# EAGLE design nrf91-feather (EAGLE 9.6.2)
AUTHOR: Jared Wolff; BOARD_NUMBER: BRD-0015; COMPANY: Circuit Dojo; DOC_NUMBER: SCH-0015; DOC_REV: 6; PN: PS-NRF91-FEATHER; TITLE: nRF91 Feather
Assembly variants: Production

## Sheet 1 of 3: Power + Headers
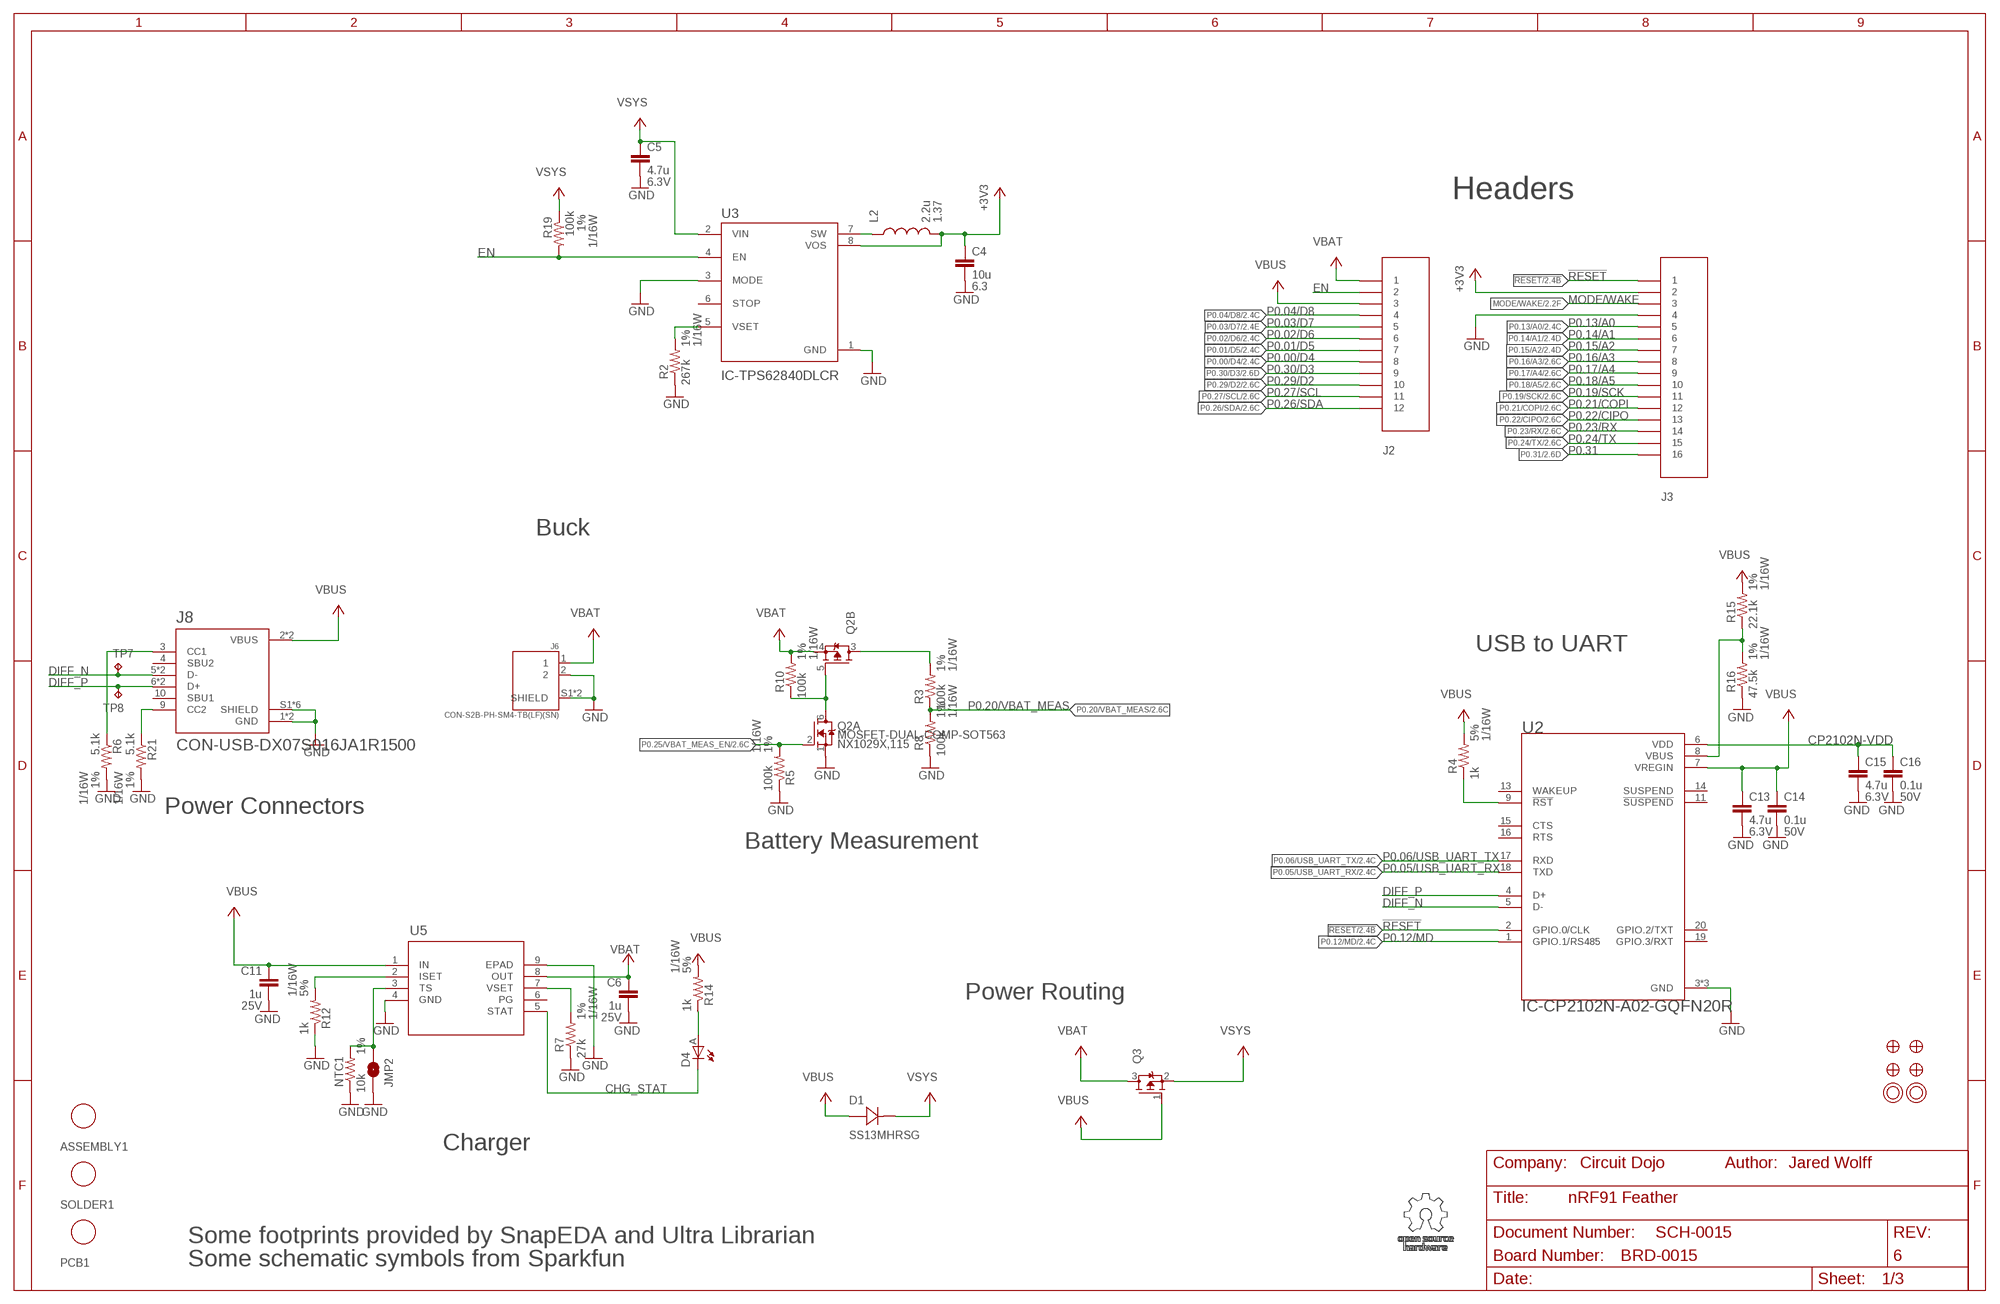
[diagram p0: schematic, sheet 1]

### Parts
ASSEMBLY1  ASSY-COST-NRF91-FEATHER  [PLACEHOLDER]
C4  10u  CAP-10U-6.3V-0603  [C0603]
C5  4.7u  CAP-4.7U-6.3V-2-0603  [C0603]
C6  1u  CAP-1U-25V-1-0402  [CAPC1005X55N]
C11  1u  CAP-1U-25V-1-0402  [CAPC1005X55N]
C13  4.7u  CAP-4.7U-6.3V-2-0603  [C0603]
C14  0.1u  CAP-0.1U-50V-0402  [CAPC1005X55N]
C15  4.7u  CAP-4.7U-6.3V-2-0603  [C0603]
C16  0.1u  CAP-0.1U-50V-0402  [CAPC1005X55N]
D1  DIO-SCHOTTKY-1A-SMA-MICRO  [SMA-MICRO]
D4  LED-ORANGE-0402  [LED_EAST1005]
J2  CON-HEADER-1X12-MALE-PIN  [CON-HEADER-1X12-MALE-PIN]  (not fitted in variant Production)
J3  CON-HEADER-1X16-MALE-PIN  [CON-HEADER-1X16-MALE-PIN]  (not fitted in variant Production)
J6  CON-S2B-PH-SM4-TB(LF)(SN)  [JST_S2B-PH-SM4-TB(LF)(SN)]
J8  CON-USB-DX07S016JA1R1500  [JAE_DX07S016JA1R1500]
JMP2  JUMPER-NO-ROUND-NO  [JUMPER-ROUND-N0]
L2  2.2u  IND-2.2U-1.37A-2X2  [IND-2P0X2P0X1P2]
NTC1  10k  NTC-10K-1%-0402  [R0402-M]
PCB1  PCB-NRF91-FEATHER  [PLACEHOLDER]
Q2  MOSFET-DUAL-COMP-SOT563  [SOT50P160X60-6N]
Q3  MOSFET-P-20V-4.7A-SOT23  [SOT23]
R2  267k  RES-267K-1%-0402  [R0402-M]
R3  100k  RES-100K-1%-0402  [R0402-M]
R4  1k  RES-1K-5%-0402  [R0402-M]
R5  100k  RES-100K-1%-0402  [R0402-M]
R6  5.1k  RES-5.1K-1%-0402  [R0402-M]
R7  27k  RES-27K-1%-0402  [R0402-M]
R8  100k  RES-100K-1%-0402  [R0402-M]
R10  100k  RES-100K-1%-0402  [R0402-M]
R12  1k  RES-1K-5%-0402  [R0402-M]
R14  1k  RES-1K-5%-0402  [R0402-M]
R15  22.1k  RES-22.1K-1%-0402  [R0402-M]
R16  47.5k  RES-47.5K-1%-0402  [R0402-M]
R19  100k  RES-100K-1%-0402  [R0402-M]
R21  5.1k  RES-5.1K-1%-0402  [R0402-M]
SOLDER1  SOLDER-PASTE-ROOM-TEMP-50G  [PLACEHOLDER]
TP7  TP-1SIDE-1P0  [TP-1P0]
TP8  TP-1SIDE-1P0  [TP-1P0]
U2  IC-CP2102N-A02-GQFN20R  [SILABS_CP2102N-A02-GQFN20R]
U3  IC-TPS62840DLCR  [SON50P200X150X100-8N]
U5  IC-BQ25170JDSGR-WSON8  [WSON8_BQ2517_TEX-L]
U$3  FIDUCIAL-1MM  [FIDUCIAL-1MM]  (not fitted in variant Production)
U$4  FIDUCIAL-1MM  [FIDUCIAL-1MM]  (not fitted in variant Production)
U$31  MOUNTING-HOLE-2.5MM-PLATED  [MOUNTING-HOLE-2.5MM-PLATED]  (not fitted in variant Production)
U$32  MOUNTING-HOLE-2.5MM-PLATED  [MOUNTING-HOLE-2.5MM-PLATED]  (not fitted in variant Production)
U$34  FIDUCIAL-1MM  [FIDUCIAL-1MM]  (not fitted in variant Production)
U$35  FIDUCIAL-1MM  [FIDUCIAL-1MM]  (not fitted in variant Production)

### Nets
!RESET: J3.1 U2.2(GPIO.0/CLK) ; also sheet 2
+3V3: C4.1 J3.2 L2.P$2 U3.8(VOS) ; also sheet 2,3
CHG_ISET: R12.2 U5.2(ISET)
CHG_STAT: D4.C U5.5(STAT)
CHG_TS: JMP2.P$1 NTC1.2 U5.3(TS)
CHG_VSET: R7.2 U5.7(VSET)
CP2102N-!RST: R4.1 U2.9(!RST)
CP2102N-VDD: C15.1 C16.1 U2.6(VDD)
DIFF_N [usb]: J8.5(D-) J8.8(D-) TP7.TP U2.5(D-)
DIFF_P [usb]: J8.6(D+) J8.7(D+) TP8.TP U2.4(D+)
EN: J2.2 R19.2 U3.4(EN)
GND: C4.2 C5.2 C6.2 C11.2 C13.2 C14.2 C15.2 C16.2 J3.4 J6.2 J6.S1(SHIELD) J6.S2(SHIELD) J8.1(GND) J8.12(GND) J8.S1(SHIELD) J8.S2(SHIELD) J8.S3(SHIELD) J8.S4(SHIELD) J8.S5(SHIELD) J8.S6(SHIELD) JMP2.P$2 NTC1.1 Q2.1(A:S) R2.1 R5.1 R6.2 R7.1 R8.1 R12.1 R16.1 R21.2 U2.3(GND) U2.12(GND) U2.21(GND) U3.1(GND) U3.3(MODE) U5.4(GND) U5.9(EPAD) ; also sheet 2,3
MODE/WAKE: J3.3 ; also sheet 2
N$1: R2.2 U3.5(VSET)
N$2: L2.P$1 U3.7(SW)
N$6: Q2.3(B:D) R3.2
N$7: Q2.5(B:G) Q2.6(A:D) R10.1
N$11: R15.1 R16.2 U2.8(VBUS)
N$13: D4.A R14.1
P0.00/D4: J2.8 ; also sheet 2
P0.01/D5: J2.7 ; also sheet 2
P0.02/D6: J2.6 ; also sheet 2
P0.03/D7: J2.5 ; also sheet 2
P0.04/D8: J2.4 ; also sheet 2,3
P0.05/USB_UART_RX: U2.18(TXD) ; also sheet 2
P0.06/USB_UART_TX: U2.17(RXD) ; also sheet 2
P0.12/MD: U2.1(GPIO.1/RS485) ; also sheet 2
P0.13/A0: J3.5 ; also sheet 2
P0.14/A1: J3.6 ; also sheet 2
P0.15/A2: J3.7 ; also sheet 2
P0.16/A3: J3.8 ; also sheet 2
P0.17/A4: J3.9 ; also sheet 2
P0.18/A5: J3.10 ; also sheet 2
P0.19/SCK: J3.11 ; also sheet 2
P0.20/VBAT_MEAS: R3.1 R8.2 ; also sheet 2
P0.21/COPI: J3.12 ; also sheet 2
P0.22/CIPO: J3.13 ; also sheet 2
P0.23/RX: J3.14 ; also sheet 2
P0.24/TX: J3.15 ; also sheet 2
P0.25/VBAT_MEAS_EN: Q2.2(A:G) R5.2 ; also sheet 2
P0.26/SDA: J2.12 ; also sheet 2,3
P0.27/SCL: J2.11 ; also sheet 2,3
P0.29/D2: J2.10 ; also sheet 2,3
P0.30/D3: J2.9 ; also sheet 2,3
P0.31: J3.16 ; also sheet 2
USB_CC1: J8.3(CC1) R6.1
USB_CC2: J8.9(CC2) R21.1
VBAT: C6.1 J2.1 J6.1 Q2.4(B:S) Q3.3(D) R10.2 U5.8(OUT)
VBUS: C11.1 C13.1 C14.1 D1.2 J2.3 J8.2(VBUS) J8.11(VBUS) Q3.1(G) R4.2 R14.2 R15.2 U2.7(VREGIN) U5.1(IN)
VSYS: C5.1 D1.1 Q3.2(S) R19.1 U3.2(VIN) ; also sheet 2
Unconnected: J8.4(SBU2) J8.10(SBU1) U2.11(!SUSPEND) U2.13(WAKEUP) U2.14(SUSPEND) U2.15(CTS) U2.16(RTS) U2.19(GPIO.3/RXT) U2.20(GPIO.2/TXT) U3.6(STOP) U5.6(PG)

### Notes on the sheet
- Headers
- Buck
- USB to UART
- Power Connectors
- Battery Measurement
- Power Routing
- Charger
- Some footprints provided by SnapEDA and Ultra Librarian
- Some schematic symbols from Sparkfun

## Sheet 2 of 3: Processor
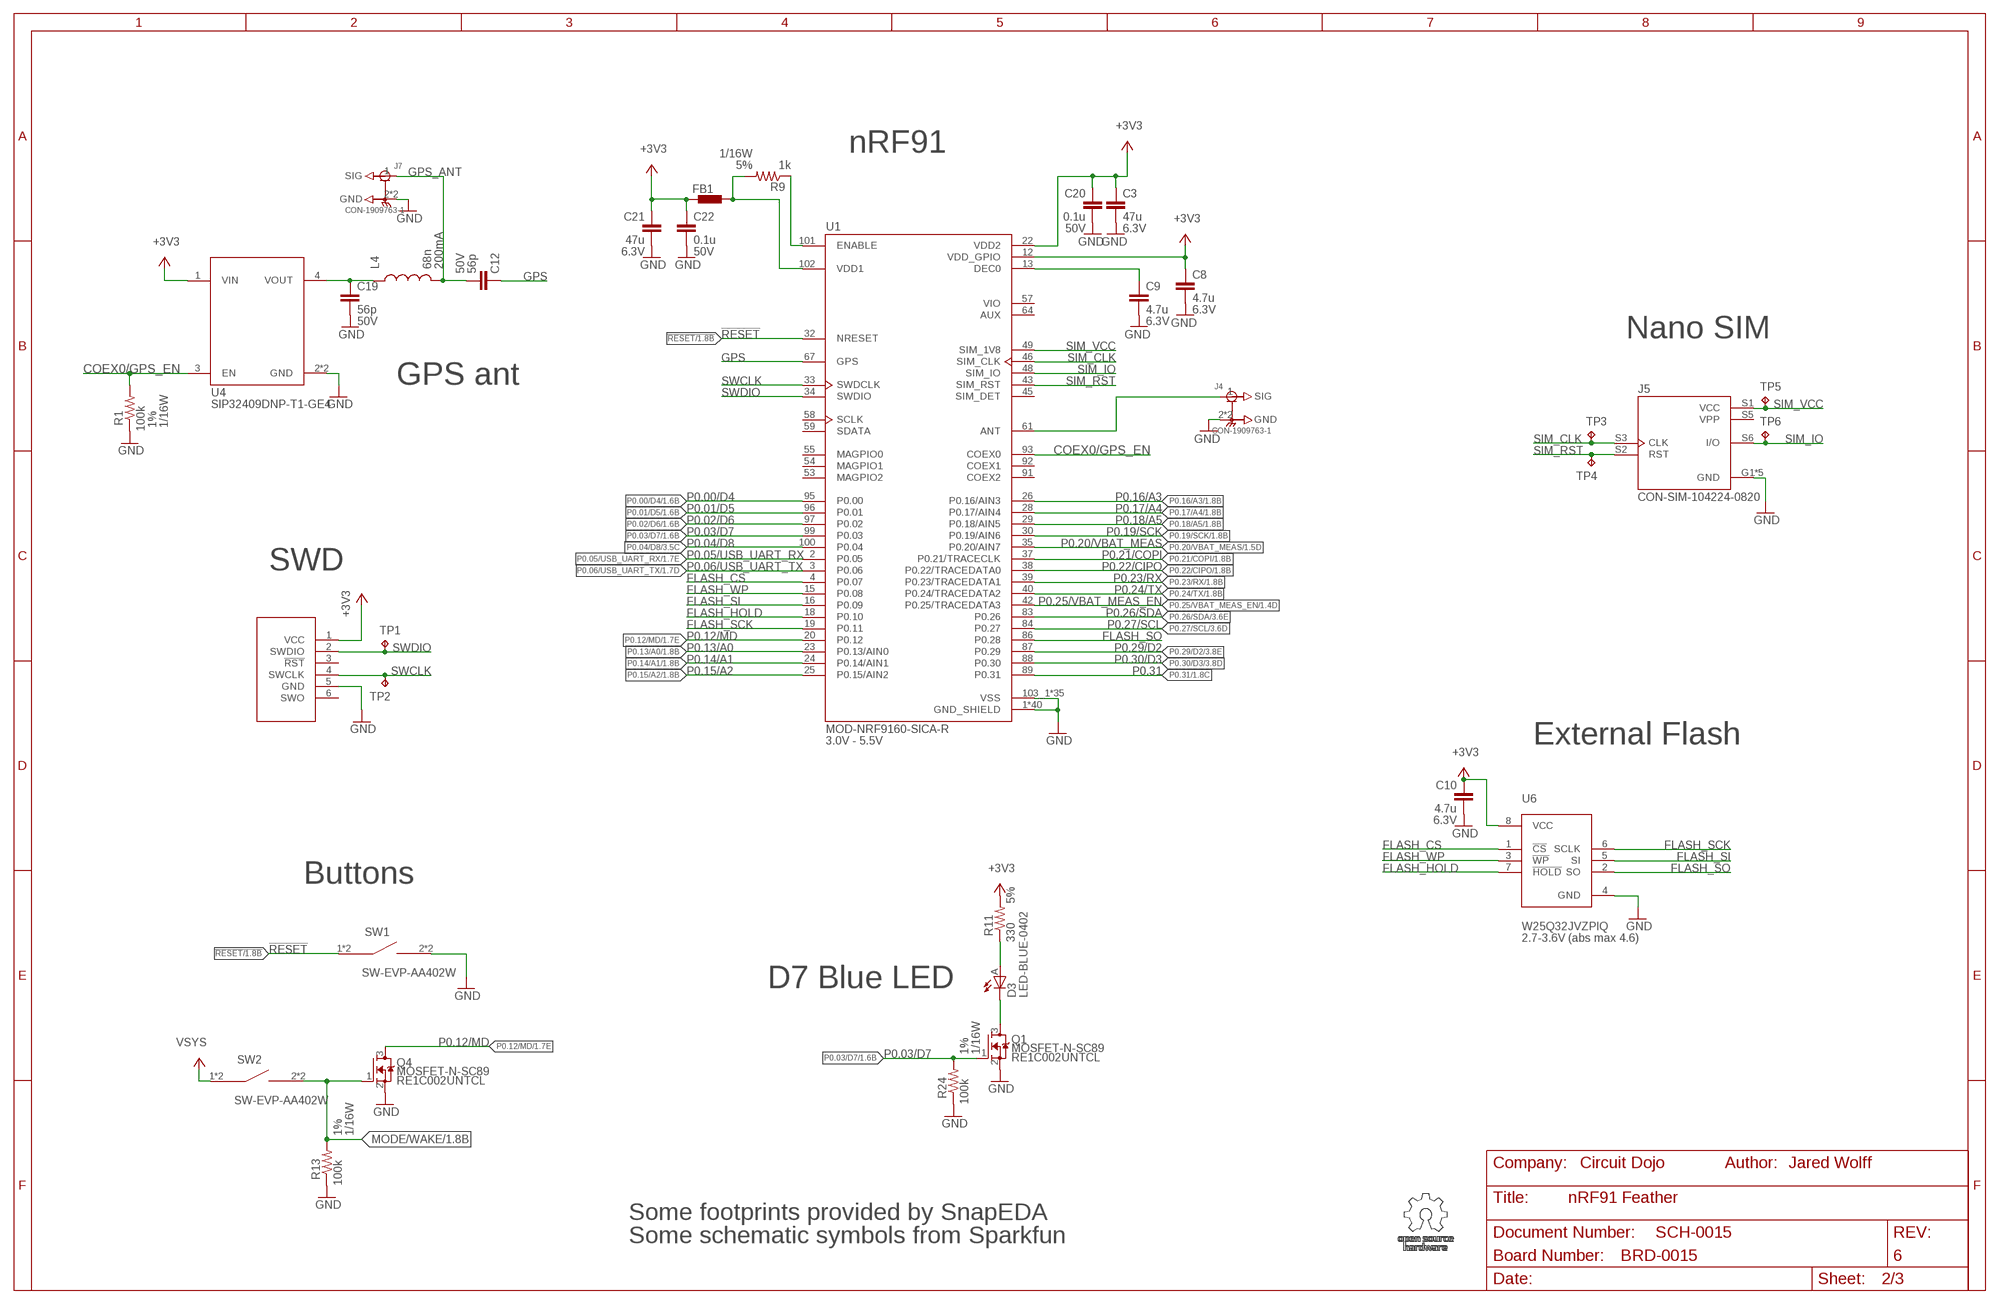
[diagram p1: schematic, sheet 2]

### Parts
C3  47u  CAP-47U-6.3V-0805  [C0805]
C8  4.7u  CAP-4.7U-6.3V-2-0603  [C0603]
C9  4.7u  CAP-4.7U-6.3V-2-0603  [C0603]
C10  4.7u  CAP-4.7U-6.3V-2-0603  [C0603]
C12  56p  CAP-56PF-50V-1-0402  [CAPC1005X55N]
C19  56p  CAP-56PF-50V-1-0402  [CAPC1005X55N]
C20  0.1u  CAP-0.1U-50V-0402  [CAPC1005X55N]
C21  47u  CAP-47U-6.3V-0805  [C0805]
C22  0.1u  CAP-0.1U-50V-0402  [CAPC1005X55N]
D3  LED-BLUE-0402  [LED_EAST1005]
FB1  FERRITE-120-100MHZ-0402  [R0402-M]
J4  CON-1909763-1  [TE_1909763-1]
J5  CON-SIM-104224-0820  [MOLEX_104224-0820]
J7  CON-1909763-1  [TE_1909763-1]
J9  CON-TC2030-MCP-NL  [TC2030-MCP-NL]  (not fitted in variant Production)
L4  68n  IND-68NH-200MA-0402  [IND0402_22N_TAI]
Q1  MOSFET-N-SC89  [DIO_RB558WMF-L]
Q4  MOSFET-N-SC89  [DIO_RB558WMF-L]
R1  100k  RES-100K-1%-0402  [R0402-M]
R9  1k  RES-1K-5%-0402  [R0402-M]
R11  330  RES-330-5%-0402  [R0402-M]
R13  100k  RES-100K-1%-0402  [R0402-M]
R24  100k  RES-100K-1%-0402  [R0402-M]
SW1  SW-EVP-AA402W  [SW-EVP-AA402W]
SW2  SW-EVP-AA402W  [SW-EVP-AA402W]
TP1  TP-1SIDE-1P0  [TP-1P0]
TP2  TP-1SIDE-1P0  [TP-1P0]
TP3  TP-1SIDE-1P0  [TP-1P0]
TP4  TP-1SIDE-1P0  [TP-1P0]
TP5  TP-1SIDE-1P0  [TP-1P0]
TP6  TP-1SIDE-1P0  [TP-1P0]
U1  MOD-NRF9160-SICA-R  [NORDIC_NRF9160-SICA-R]
U4  POWER-SWITCH-SIP32409-DFN4  [SON50P160X120X60-5N]
U6  FLASH-W25Q32JVZPIQ-WSON  [WIN_ZP-8-L]

### Nets
!RESET: SW1.1 SW1.3 U1.32(NRESET) ; also sheet 1
+3V3: C3.1 C8.1 C10.1 C20.1 C21.1 C22.1 FB1.1 J9.1(VCC) R11.2 U1.12(VDD_GPIO) U1.22(VDD2) U4.1(VIN) U6.8(VCC) ; also sheet 1,3
ANT [rf]: J4.1(SIG) U1.61(ANT)
COEX0/GPS_EN: R1.2 U1.93(COEX0) U4.3(EN)
FLASH_CS: U1.4(P0.07) U6.1(!CS)
FLASH_HOLD: U1.18(P0.10) U6.7(!HOLD)
FLASH_SCK: U1.19(P0.11) U6.6(SCLK)
FLASH_SI: U1.16(P0.09) U6.5(SI)
FLASH_SO: U1.86(P0.28) U6.2(SO)
FLASH_WP: U1.15(P0.08) U6.3(!WP)
GND: C3.2 C8.2 C9.2 C10.2 C19.2 C20.2 C21.2 C22.2 J4.2(GND) J4.3(GND) J5.G1(GND) J5.G2(GND) J5.G3(GND) J5.G4(GND) J5.S4(GND) J7.2(GND) J7.3(GND) J9.5(GND) Q1.2(S) Q4.2(S) R1.1 R13.1 R24.1 SW1.2 SW1.4 U1.1(GND_SHIELD) U1.5(GND_SHIELD) U1.6(GND_SHIELD) U1.7(GND_SHIELD) U1.8(GND_SHIELD) U1.9(GND_SHIELD) U1.11(GND_SHIELD) U1.14(GND_SHIELD) U1.17(GND_SHIELD) U1.21(GND_SHIELD) U1.27(GND_SHIELD) U1.31(GND_SHIELD) U1.36(GND_SHIELD) U1.41(GND_SHIELD) U1.44(GND_SHIELD) U1.47(GND_SHIELD) U1.50(GND_SHIELD) U1.52(GND_SHIELD) U1.56(GND_SHIELD) U1.60(GND_SHIELD) U1.62(GND_SHIELD) U1.63(GND_SHIELD) U1.65(GND_SHIELD) U1.66(GND_SHIELD) U1.68(GND_SHIELD) U1.69(GND_SHIELD) U1.72(GND_SHIELD) U1.74(GND_SHIELD) U1.75(GND_SHIELD) U1.76(GND_SHIELD) U1.77(GND_SHIELD) U1.78(GND_SHIELD) U1.79(GND_SHIELD) U1.80(GND_SHIELD) U1.81(GND_SHIELD) U1.82(GND_SHIELD) U1.85(GND_SHIELD) U1.90(GND_SHIELD) U1.94(GND_SHIELD) U1.98(GND_SHIELD) U1.103_1(VSS) U1.103_2(VSS) U1.103_3(VSS) U1.103_4(VSS) U1.103_5(VSS) U1.103_6(VSS) U1.103_7(VSS) U1.103_8(VSS) U1.103_9(VSS) U1.103_10(VSS) U1.103_11(VSS) U1.103_12(VSS) U1.103_13(VSS) U1.103_14(VSS) U1.103_15(VSS) U1.103_16(VSS) U1.103_17(VSS) U1.103_18(VSS) U1.103_19(VSS) U1.103_20(VSS) U1.103_21(VSS) U1.103_22(VSS) U1.103_23(VSS) U1.103_24(VSS) U1.103_25(VSS) U1.103_26(VSS) U1.103_27(VSS) U1.103_28(VSS) U1.103_29(VSS) U1.103_30(VSS) U1.103_31(VSS) U1.103_32(VSS) U1.103_33(VSS) U1.103_34(VSS) U1.103_35(VSS) U4.2(GND) U4.5(GND) U6.4(GND) ; also sheet 1,3
GPS [rf]: C12.1 U1.67(GPS)
GPS_ANT [rf]: C12.2 J7.1(SIG) L4.2
LNA_SW_OUT: C19.1 L4.1 U4.4(VOUT)
MODE/WAKE: Q4.1(G) R13.2 SW2.2 SW2.4 ; also sheet 1
N$4: R9.1 U1.101(ENABLE)
N$5: C9.1 U1.13(DEC0)
N$8: D3.A R11.1
N$12: D3.C Q1.3(D)
N$16: FB1.2 R9.2 U1.102(VDD1)
P0.00/D4: U1.95(P0.00) ; also sheet 1
P0.01/D5: U1.96(P0.01) ; also sheet 1
P0.02/D6: U1.97(P0.02) ; also sheet 1
P0.03/D7: Q1.1(G) R24.2 U1.99(P0.03) ; also sheet 1
P0.04/D8: U1.100(P0.04) ; also sheet 1,3
P0.05/USB_UART_RX: U1.2(P0.05) ; also sheet 1
P0.06/USB_UART_TX: U1.3(P0.06) ; also sheet 1
P0.12/MD: Q4.3(D) U1.20(P0.12) ; also sheet 1
P0.13/A0: U1.23(P0.13/AIN0) ; also sheet 1
P0.14/A1: U1.24(P0.14/AIN1) ; also sheet 1
P0.15/A2: U1.25(P0.15/AIN2) ; also sheet 1
P0.16/A3: U1.26(P0.16/AIN3) ; also sheet 1
P0.17/A4: U1.28(P0.17/AIN4) ; also sheet 1
P0.18/A5: U1.29(P0.18/AIN5) ; also sheet 1
P0.19/SCK: U1.30(P0.19/AIN6) ; also sheet 1
P0.20/VBAT_MEAS: U1.35(P0.20/AIN7) ; also sheet 1
P0.21/COPI: U1.37(P0.21/TRACECLK) ; also sheet 1
P0.22/CIPO: U1.38(P0.22/TRACEDATA0) ; also sheet 1
P0.23/RX: U1.39(P0.23/TRACEDATA1) ; also sheet 1
P0.24/TX: U1.40(P0.24/TRACEDATA2) ; also sheet 1
P0.25/VBAT_MEAS_EN: U1.42(P0.25/TRACEDATA3) ; also sheet 1
P0.26/SDA: U1.83(P0.26) ; also sheet 1,3
P0.27/SCL: U1.84(P0.27) ; also sheet 1,3
P0.29/D2: U1.87(P0.29) ; also sheet 1,3
P0.30/D3: U1.88(P0.30) ; also sheet 1,3
P0.31: U1.89(P0.31) ; also sheet 1
SIM_CLK: J5.S3(CLK) TP3.TP U1.46(SIM_CLK)
SIM_IO: J5.S6(I/O) TP6.TP U1.48(SIM_IO)
SIM_RST: J5.S2(RST) TP4.TP U1.43(SIM_RST)
SIM_VCC: J5.S1(VCC) TP5.TP U1.49(SIM_1V8)
SWCLK: J9.4(SWCLK) TP2.TP U1.33(SWDCLK)
SWDIO: J9.2(SWDIO) TP1.TP U1.34(SWDIO)
VSYS: SW2.1 SW2.3 ; also sheet 1
Unconnected: J9.3(!RST) J9.6(SWO) U1.45(SIM_DET) U1.53(MAGPIO2) U1.54(MAGPIO1) U1.55(MAGPIO0) U1.58(SCLK) U1.59(SDATA) U1.64(AUX) U1.91(COEX2) U1.92(COEX1)

### Notes on the sheet
- nRF91
- Nano SIM
- GPS ant
- SWD
- 3.0V - 5.5V | External Flash
- Buttons
- 2.7-3.6V (abs max 4.6)
- D7 Blue LED
- Some footprints provided by SnapEDA
- Some schematic symbols from Sparkfun

## Sheet 3 of 3: Wakeup Source
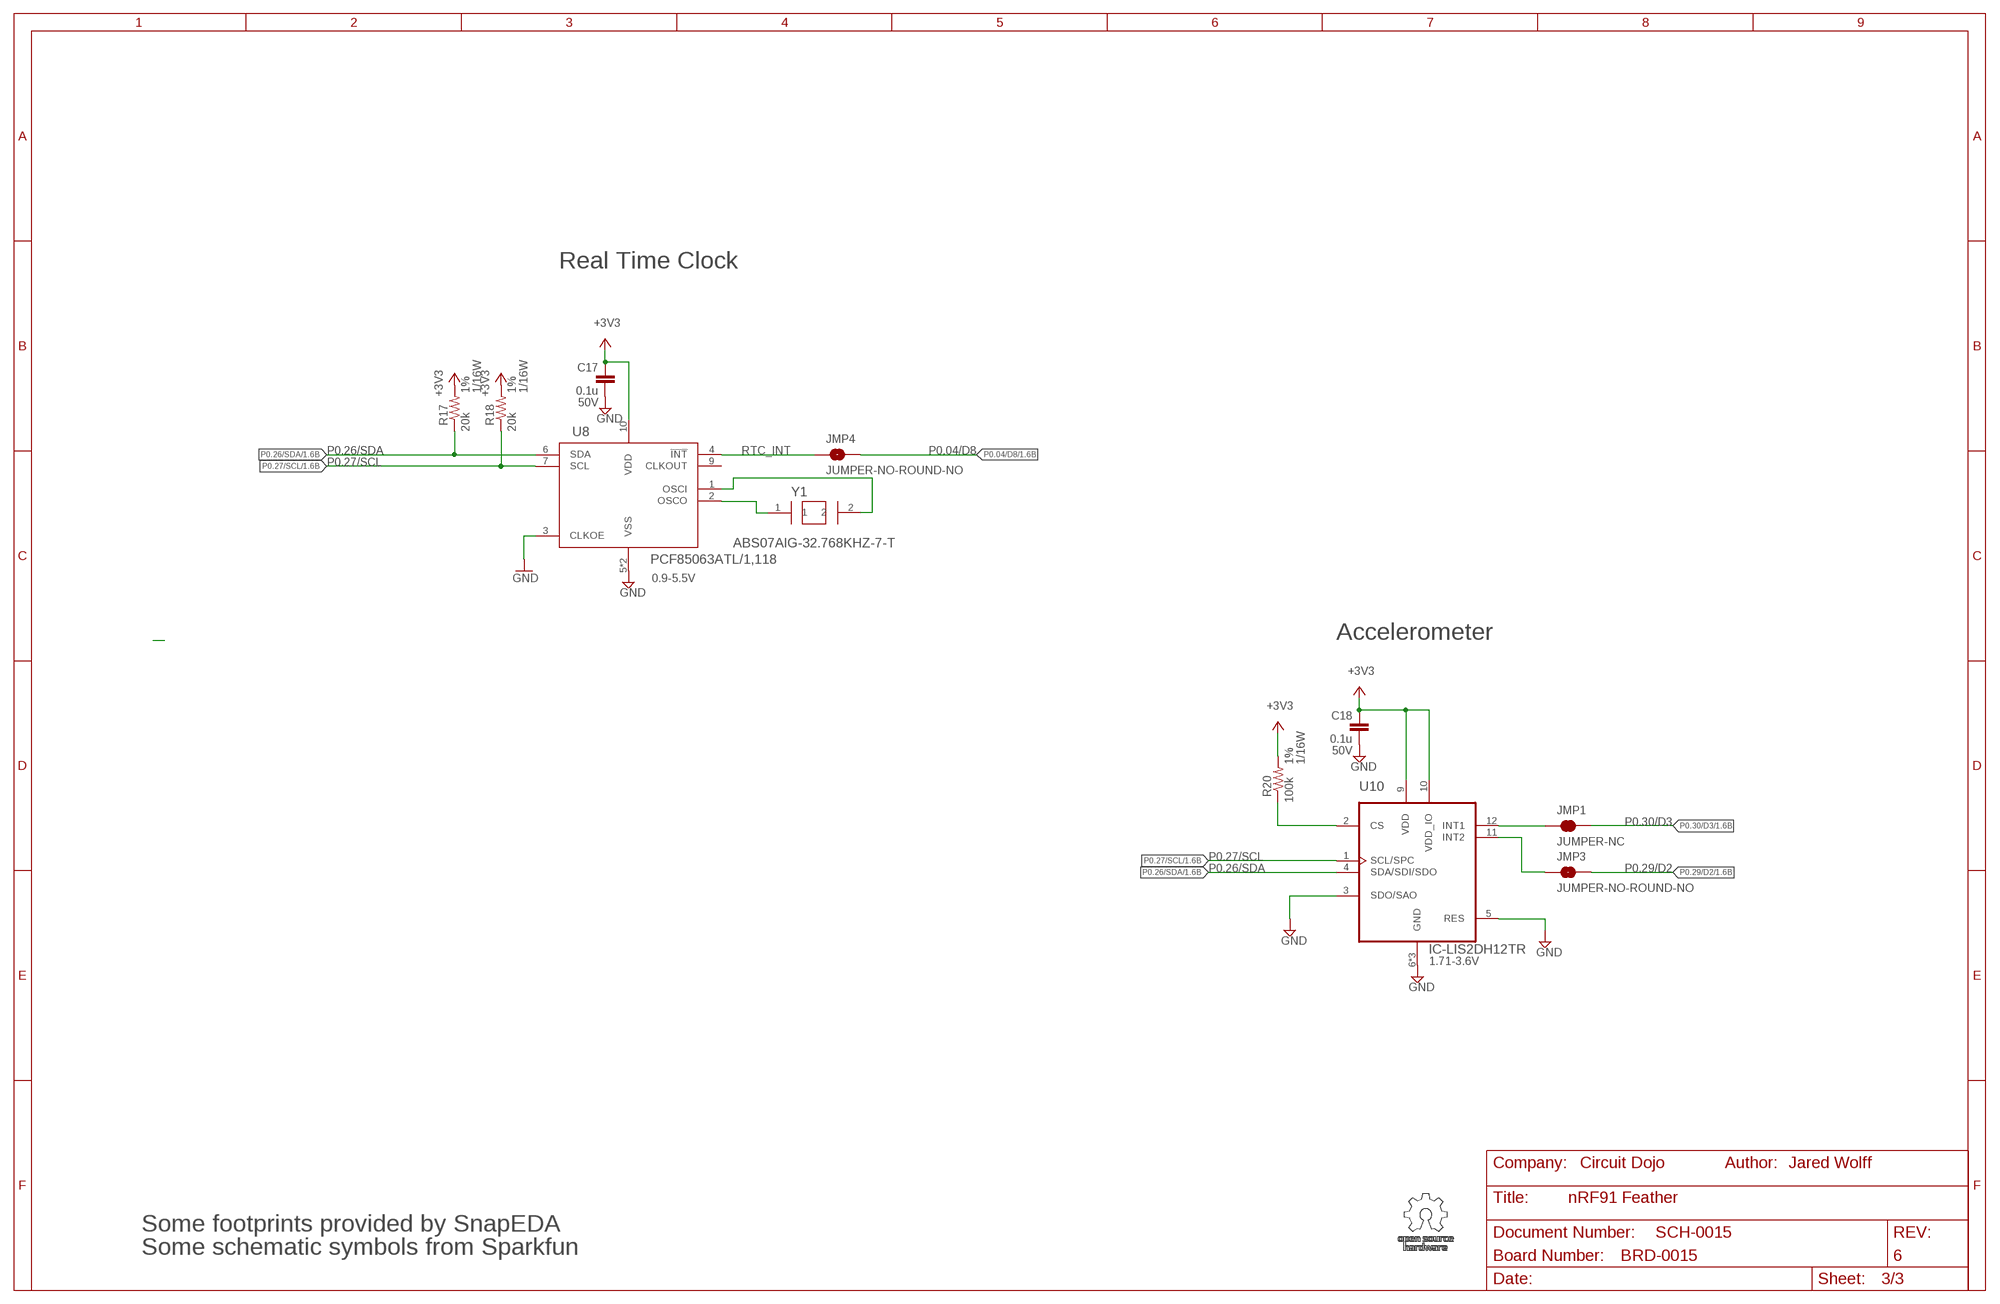
[diagram p2: schematic, sheet 3]

### Parts
C17  0.1u  CAP-0.1U-50V-0402  [CAPC1005X55N]
C18  0.1u  CAP-0.1U-50V-0402  [CAPC1005X55N]
JMP1  JUMPER-NC  [JUMPER-ROUND-NC]
JMP3  JUMPER-NO-ROUND-NO  [JUMPER-ROUND-N0]
JMP4  JUMPER-NO-ROUND-NO  [JUMPER-ROUND-N0]
R17  20k  RES-20K-1%-0402  [R0402-M]
R18  20k  RES-20K-1%-0402  [R0402-M]
R20  100k  RES-100K-1%-0402  [R0402-M]
U8  IC-PCF85063ATL/1  [DFN10_2P7X2P7-L]
U10  IC-LIS2DH12TR  [PQFN50P200X200100-12N]
Y1  XTAL-ABS07AIG-32.768KHZ-7-T  [XTAL320X150X90]

### Nets
+3V3: C17.1 C18.1 R17.2 R18.2 R20.2 U8.10(VDD) U10.9(VDD) U10.10(VDD_IO) ; also sheet 1,2
GND: C17.2 C18.2 U8.3(CLKOE) U8.5(VSS) U8.11(VSS) U10.3(SDO/SAO) U10.5(RES) U10.6(GND) U10.7(GND) U10.8(GND) ; also sheet 1,2
LIS2DH_INT1: JMP1.P$1 U10.12(INT1)
LIS2DH_INT2: JMP3.P$1 U10.11(INT2)
N$3: R20.1 U10.2(CS)
N$10: U8.1(OSCI) Y1.2
N$18: U8.2(OSCO) Y1.1
P0.04/D8: JMP4.P$2 ; also sheet 1,2
P0.26/SDA: R17.1 U8.6(SDA) U10.4(SDA/SDI/SDO) ; also sheet 1,2
P0.27/SCL: R18.1 U8.7(SCL) U10.1(SCL/SPC) ; also sheet 1,2
P0.29/D2: JMP3.P$2 ; also sheet 1,2
P0.30/D3: JMP1.P$2 ; also sheet 1,2
RTC_INT: JMP4.P$1 U8.4(!INT)
Unconnected: U8.9(CLKOUT)

### Notes on the sheet
- Real Time Clock
- 0.9-5.5V
- Accelerometer
- 1.71-3.6V
- Some footprints provided by SnapEDA
- Some schematic symbols from Sparkfun

## Power pins joined to a net without a drawn wire
VIO: U1.57(VIO)
VPP: J5.S5(VPP)

## Library data of the parts
ASSEMBLY1 = wolff-den:ASSY-COST; MPN: ASSY-COST-NRF9160-FEATHER
C3 C21 = wolff-den:CAP: CAPACITOR; DESC: CAP CER 47UF 6.3V X5R 0805; DIGIKEYPN: 587-1779-1-ND; MPN: JMK212BJ476MG-T; VOLTHIGH: 6.3V
C4 = wolff-den:CAP: CAPACITOR; DESC: CAP CER 10UF 6.3V X5R 0603; DIGIKEYPN: 587-5869-1-ND; MPN: JMK107ABJ106MA-T; VOLTHIGH: 6.3
C5 C8-C10 C13 C15 = wolff-den:CAP: CAPACITOR; DESC: CAP CER 4.7UF 6.3V X7R 0603; DIGIKEYPN: 587-4906-1-ND; MPN: JMK107BB7475MA-T; TEMPHIGH: 125; TEMPLOW: -55; VOLTHIGH: 6.3V
C6 C11 = wolff-den:CAP: CAPACITOR; DESC: CAP CER 1UF 25V X5R 0402; DIGIKEYPN: 445-9081-1-ND; MF: TDK; MPN: C1005X5R1E105M050BC; VOLTHIGH: 25V
C12 C19 = wolff-den:CAP: CAPACITOR; DESC: CAP CER 56PF 50V C0G/NPO 0402; DIGIKEYPN: 311-1656-1-ND; MF: Yageo; MPN: CC0402GRNPO9BN560; VOLTHIGH: 50V
C14 C16-C18 C20 C22 = wolff-den:CAP: CAPACITOR; DESC: CAP CER 0.1UF 50V X5R 0402; DIGIKEYPN: 587-3499-1-ND; MF: Taiyo Yuden; MPN: UMK105BJ104KV-F; VOLTHIGH: 50V
D1 = wolff-den:DIO-SCHOTTKY: DIODE SCHOTTKY 40V 3A MINI2; DESC: DIODE SCHOTTKY 30V 1A MICRO SMA; DIGIKEYPN: SS13MHRSGCT-ND; MPN: SS13MHRSG
D3 = wolff-den:LED; DESC: LED BLUE CLEAR 2SMD; DIGIKEYPN: 1080-1558-1-ND; MF: Everlight Electronics Co Ltd; MPN: EAST10052BA0
D4 = wolff-den:LED; DESC: EAST1005GA1; DIGIKEYPN: 1080-EAST1005GA1CT-ND; MF: Everlight Electronics Co Ltd; MPN: EAST1005GA1
FB1 = wolff-den:FERRITE: FERRITE BEAD; DESC: FERRITE BEAD 120 OHM 0402 1LN; DIGIKEYPN: 490-5439-1-ND; MF: Murata Electronics; MPN: BLM15AX121SN1D
J2 = wolff-den:CON-HEADER-1X12; ALIAS: POGO-1.9MM-S19-501
J3 = wolff-den:CON-HEADER-1X16
J4 J7 = wolff-den:CON-1909763-1: VAO ITEM, MINI RF HEADER; DESC: CONN UMCC JACK STR 50OHM SMD; DIGIKEYPN: A118077CT-ND; MF: TE Connectivity; MPN: 1909763-1
J5 = wolff-den:CON-SIM: Conn SIM SKT 6 POS 2.54mm Solder RA SMD; DESC: NANOSIM SOCKET 1.11H P/PULL TYPE; DESCRIPTION: 6 Position Card Connector NANO SIM Surface Mount, Right Angle Gold; MF: Molex; MPN: 104224-0820; PACKAGE: None; PRICE: None
J6 = wolff-den:CON-S2B-PH-SM4-TB(LF)(SN): PH Series 2 Position 2 mm Pitch Surface Mount Side Entry Shrouded Header; DESC: CONN HEADER SMD R/A 2POS 2MM; DIGIKEYPN: 455-1749-1-ND; MF: JST Sales; MPN: S2B-PH-SM4-TB(LF)(SN)
J8 = wolff-den:CON-USB-DX07S016JA1R1500: USB-C (USB TYPE-C) USB 2.0 Receptacle Connector 24 (16+8 Dummy) Position Surface Mount, Right Angle; Through Hole; DESCRIPTION: USB-C (USB TYPE-C) USB 2.0 Receptacle Connector 24 (16+8 Dummy) Position Surface Mount, Right Angle; Through Hole; DIGI-KEY_PART_NUMBER: 670-DX07S016JA1R1500CT-ND; MF: JAE Electronics; MP: DX07S016JA1R1500; PACKAGE: None
J9 = wolff-den:CON-TC2030-MCP-NL: CONN TAG CONNECT PROG; DESC: TC2030-MCP-NL; MPN: TC2030-MCP-NL
JMP1 = wolff-den:JUMPER-NC
JMP2-JMP4 = wolff-den:JUMPER-NO: Different jumper types: cutable, solderable
L2 = wolff-den:IND: INDUCTOR; CURRENT: 1.37; DESC: FIXED IND 2.2UH 1.37A 107MOHM SM; DIGIKEYPN: 587-3450-2-ND; MPN: NRS2012T2R2MGJ
L4 = wolff-den:IND: INDUCTOR; CURRENT: 200mA; DESC: FIXED IND 68NH 200MA 1.25 OHM; DIGIKEYPN: ‎490-15092-1-ND‎; MPN: LQG15HN68NH02D‎
NTC1 = wolff-den:NTC: THERMISTOR NTC 10KOHM 3380K 0402; DIGIKEYPN: 490-18149-1-ND; MF: Murata Electronics; MPN: NCU15XH103F60RC; TOLERANCE: 1%
PCB1 = wolff-den:PCB; MPN: BRD-0015
Q1 Q4 = wolff-den:MOSFET-N; DESC: MOSFET N-CH 20V 0.2A EMT3; DIGIKEYPN: RE1C002UNTCLCT-ND; MF: Rohm Semiconductor; MPN: RE1C002UNTCL
Q2 = wolff-den:MOSFET-DUAL-COMP; DESC: MOSFET N/P-CH 60V/50V SOT666; DIGIKEYPN: 1727-1277-1-ND; MPN: NX1029X,115
Q3 = wolff-den:MOSFET-P: MOSFET P-CH; DESC: MOSFET P-CHANNEL 20V 4.7A SOT23; DIGIKEYPN: TSM500P02CXRFGCT-ND; MPN: TSM500P02CX RFG
R1 R3 R5 R8 R10 R13 R19 R20 R24 = wolff-den:RES: RESISTOR; DESC: RES SMD 100K OHM 1% 1/16W 0402; DIGIKEYPN: 311-100KLRCT-ND; MPN: RC0402FR07100KL; POWER: 1/16W; TOLERANCE: 1%
R2 = wolff-den:RES: RESISTOR; DESC: RES 267K OHM 1% 1/16W 0402; DIGIKEYPN: YAG3079CT-ND; MPN: RC0402FR-07267KL; POWER: 1/16W; TOLERANCE: 1%
R4 R9 R12 R14 = wolff-den:RES: RESISTOR; DESC: RES SMD 1K OHM 5% 1/16W 0402; DIGIKEYPN: 311-1.0KJRCT-ND; MPN: RC0402JR-071KL; POWER: 1/16W; TOLERANCE: 5%
R6 R21 = wolff-den:RES: RESISTOR; DESC: RES 5.1K OHM 1% 1/16W 0402; DIGIKEYPN: 311-5.10KLRCT-ND; MPN: RC0402FR-075K1L; POWER: 1/16W; TOLERANCE: 1%
R7 = wolff-den:RES: RESISTOR; DESC: RES SMD 27K OHM 1% 1/16W 0402; MF: Yageo; POWER: 1/16W; TOLERANCE: 1%
R11 = wolff-den:RES: RESISTOR; DESC: RES SMD 330 OHM 5% 1/16W 0402; DIGIKEYPN: 311-330JRCT-ND; MF: Yageo; MPN: RC0402JR-07330RL; TOLERANCE: 5%
R15 = wolff-den:RES: RESISTOR; DESC: RES SMD 22.1K OHM 1% 1/16W 0402; DIGIKEYPN: 311-22.1KLRCT-ND; MF: Yageo; MPN: RC0402FR-0722K1L; POWER: 1/16W; TOLERANCE: 1%
R16 = wolff-den:RES: RESISTOR; DESC: RES SMD 47.5K OHM 1% 1/16W 0402; DIGIKEYPN: 311-47.5KLRCT-ND; MF: Yageo; MPN: RC0402FR-0747K5L; POWER: 1/16W; TOLERANCE: 1%
R17 R18 = wolff-den:RES: RESISTOR; DESC: RES SMD 20K OHM 1% 1/16W 0402; DIGIKEYPN: 311-20.0KLRCT-ND; MF: Yageo; MPN: RC0402FR-0720KL; POWER: 1/16W; TOLERANCE: 1%
SOLDER1 = wolff-den:SOLDER; DESC: THERMALLY STABLE SOLDER PASTE NO; MPN: TS391SNL50; MQTY: 150
SW1 SW2 = wolff-den:SW-EVP-AA402W; DESC: SWITCH TACTILE SPST-NO 0.02A 15V; DIGIKEYPN: P13349SCT-ND; MPN: EVP-AA402W
TP1-TP8 = wolff-den:TP: TEST POINT
U1 = wolff-den:MOD-NRF9160-SICA-R: NRF9160-SICA-R; DESC: IC RF TXRX+MCU CELL LTE-M/NB-IOT; DIGIKEYPN: 1490-1076-1-ND; MF: Nordic Semiconductor; MPN: NRF9160-SICA-R
U2 = wolff-den:IC-CP2102N-A02-GQFN20R: IC USB TO UART BRIDGE QFN20; DESC: IC USB TO UART BRIDGE QFN20; DIGIKEYPN: 336-5886-1-ND; MF: Silicon Labs; MPN: CP2102N-A02-GQFN20R
U3 = wolff-den:IC-TPS62840DLCR: None Check prices <https://snapeda.com/parts/TPS62840DLCR/Texas%20Instruments/view-part/?ref=eda> Check availability <https://pricing.snapeda.com/parts/TPS62840DLCR/Texas%20Instruments/view-part?ref=eda>; AVAILABILITY: In Stock; DESCRIPTION: 60-nA quiescent current (IQ), 1.8-V to 6.5-VIN, high-efficiency 750-mA step-down converter; MF: Texas Instruments; MP: TPS62840DLCR; PACKAGE: VSON-HR-8 Texas Instruments; PRICE: None; PURCHASE-URL: https://pricing.snapeda.com/search/part/TPS62840DLCR/?ref=eda
U4 = wolff-den:POWER-SWITCH: IC SWITCH; DESC: IC PWR SWITCH N-CHAN 1:1 4TDFN; DIGIKEYPN: SIP32409DNP-T1-GE4CT-ND; MF: Vishay Siliconix; MPN: SIP32409DNP-T1-GE4
U5 = wolff-den:IC-BQ25170JDSGR; COPYRIGHT: Copyright (C) 2022 Ultra Librarian. All rights reserved.; DESC: IC BATTERY MANAGEMENT; DIGIKEYPN: 296-BQ25170JDSGRTR-ND; MF: Texas Instruments; MPN: BQ25170JDSGR
U6 = wolff-den:FLASH: NOR FLASH; DESC: IC FLASH 32M SPI 133MHZ 8WSON; DIGIKEYPN: W25Q32JVZPIQ-ND; MPN: W25Q32JVZPIQ
U8 = wolff-den:IC-PCF85063ATL/1; DESC: IC RTC CLK/CALENDAR I2C 10-SON; DIGIKEYPN: 568-10235-1-ND; MF: NXP; MPN: PCF85063ATL/1,118
U10 = wolff-den:IC-LIS2DH12TR: ACCEL 2-16G I2C/SPI 12LGA; AVAILABILITY: Good; DESCRIPTION: MEMS digital output motion sensor: ultra low-power high performance 3-axes femto accelerometer; DIGIKEYPN: 497-14851-1-ND; MF: STMicroelectronics; MPN: LIS2DH12TR; PACKAGE: LGA-12 STMicroelectronics; PRICE: 0.85 USD; VOLTHIGH: 3.6; VOLTLOW: 1.71
U$3 U$4 U$34 U$35 = wolff-den:FIDUCIAL
U$31 U$32 = wolff-den:MOUNTING-HOLE
Y1 = wolff-den:XTAL-ABS07AIG-32.768KHZ-7-T: ABS07 Series 32.768 kHz ±20 ppm 12.5 pF -40 to +85 C SMT Low Profile Crystal; DESC: CRYSTAL 32.768KHZ 7PF SMD; DIGIKEYPN: 535-13350-1-ND; MF: Abracon; MPN: ABS07AIG-32.768KHZ-7-T

## Net classes
1 usb: width 0.15 mm
2 rf: width 0.3 mm

## Board
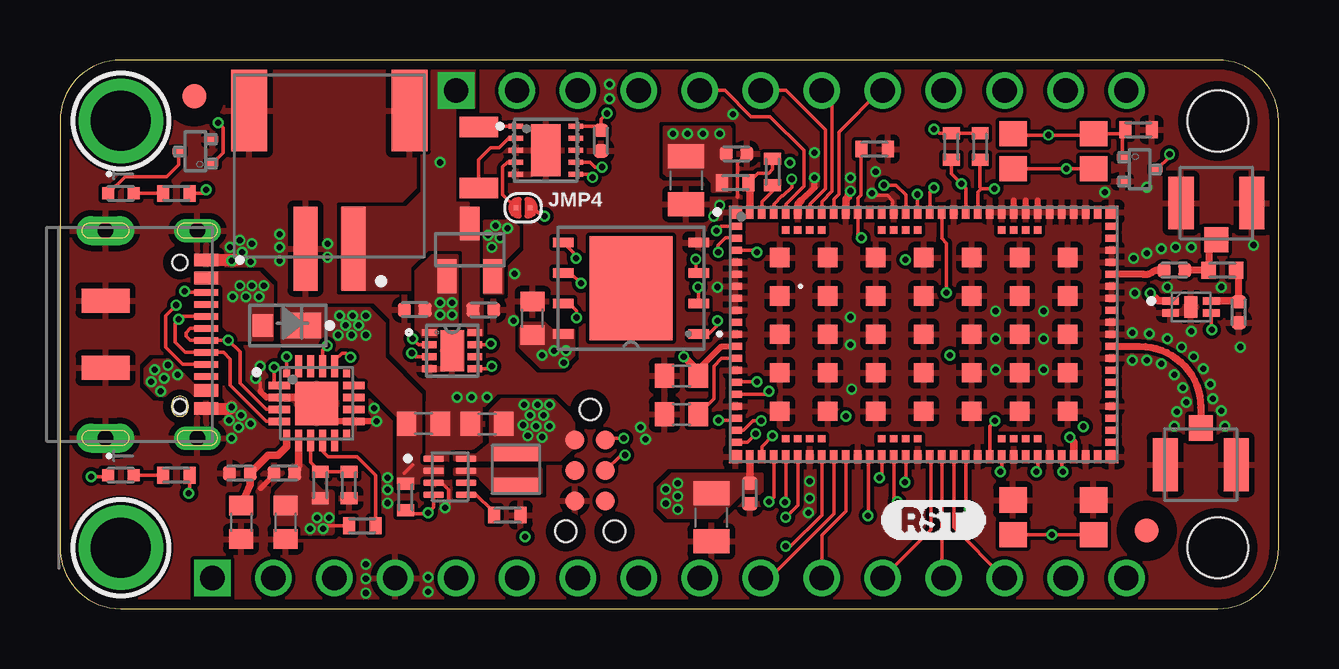
[diagram p3: board, top side]
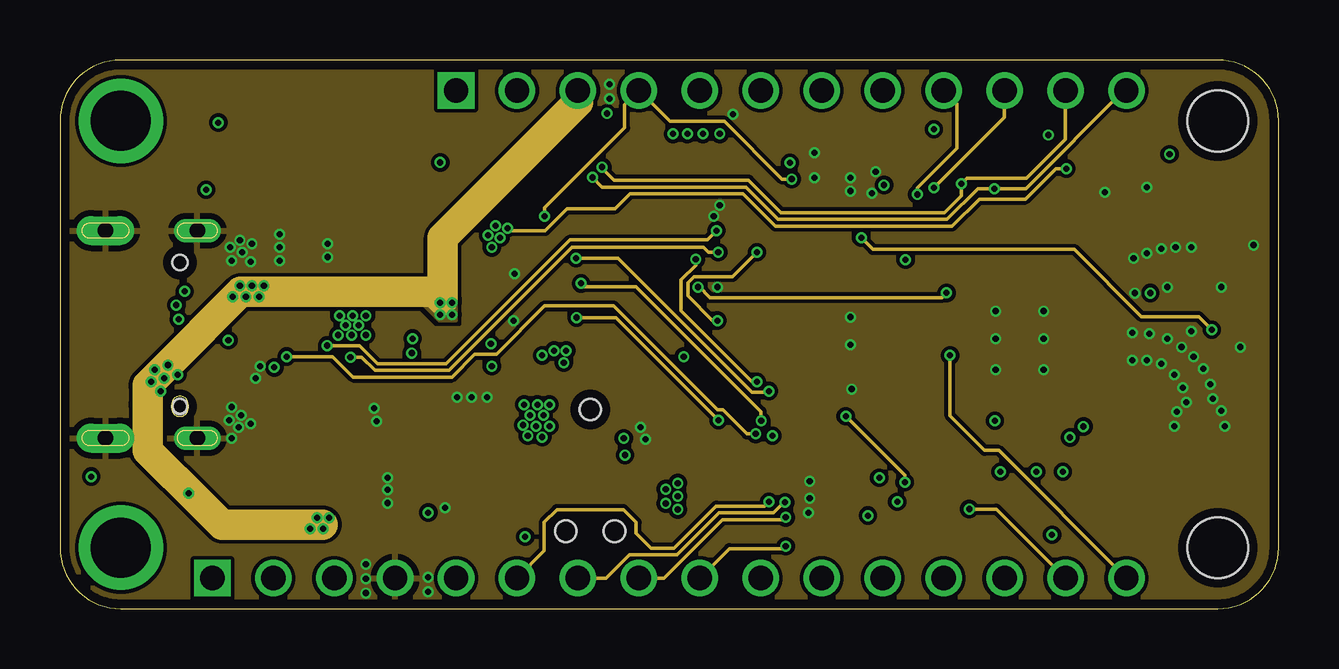
[diagram p4: board, inner layer Route2]
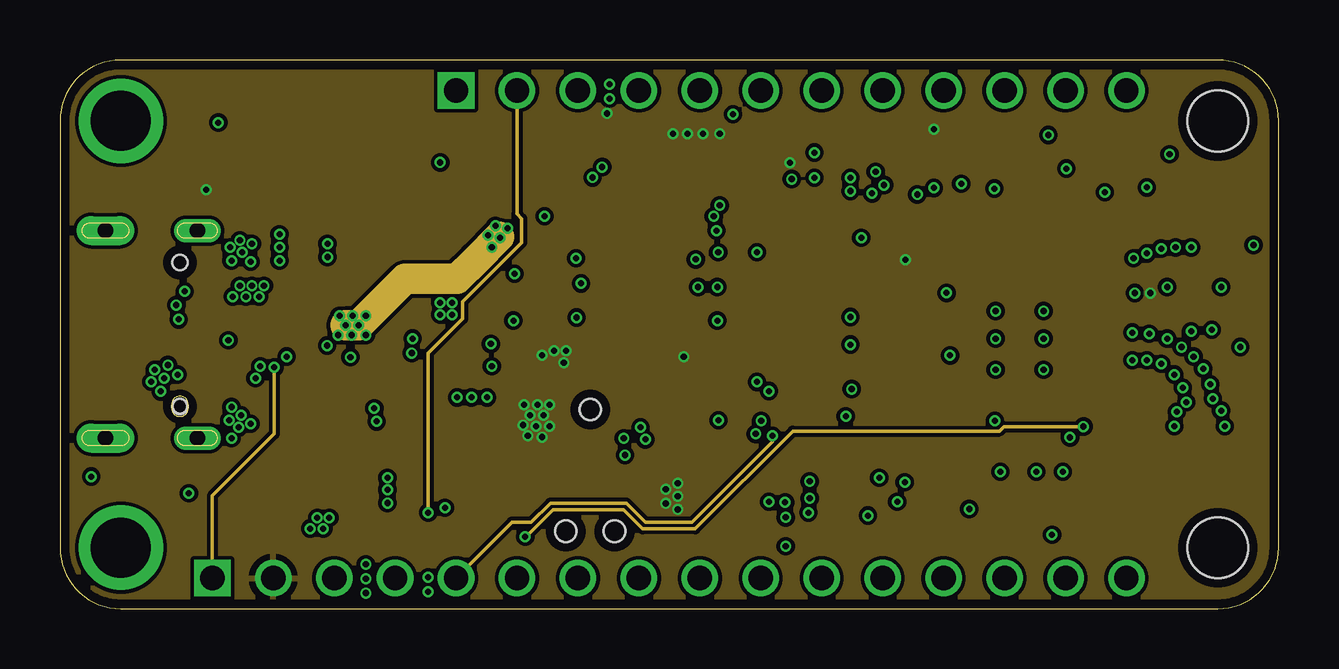
[diagram p5: board, inner layer Route15]
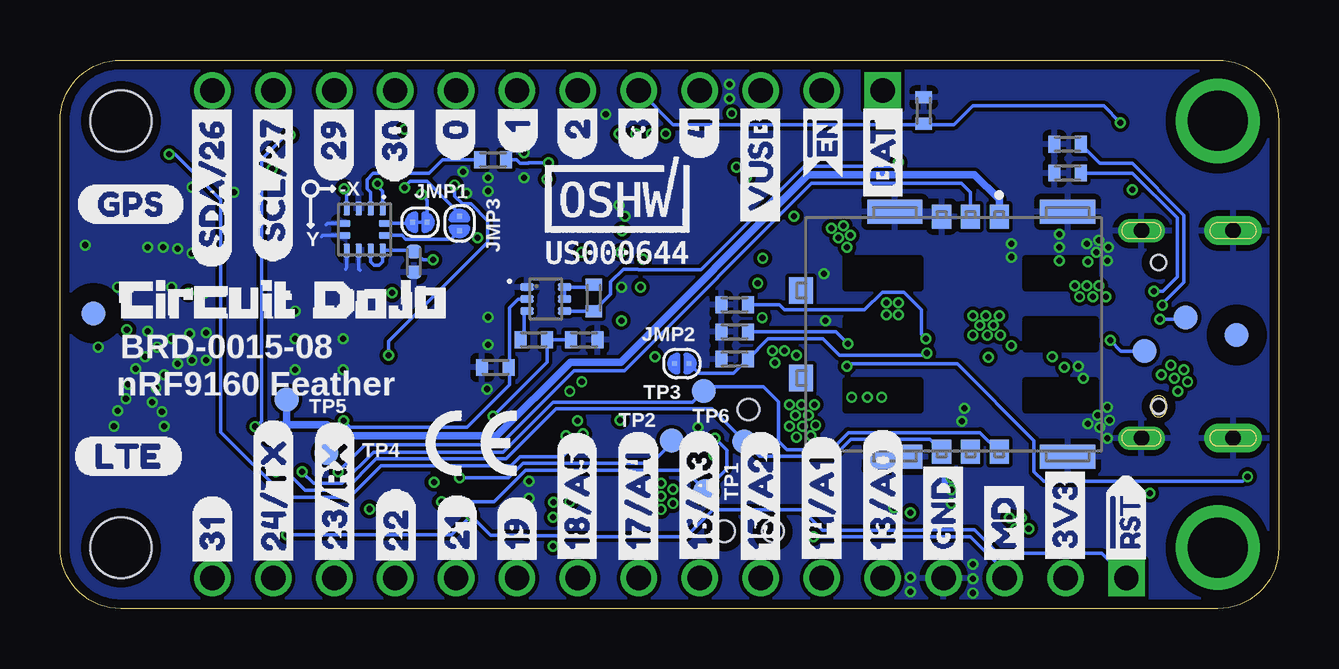
[diagram p6: board, bottom side, seen from below]

Size 50.8 x 22.86 mm. Coordinates in mm from the lower left corner, seen from the top.
Outline: 2.54,0 48.26,0 arc90 50.8,2.54 50.8,20.32 arc90 48.26,22.86 2.54,22.86 arc90 0,20.32 0,2.54 arc90 2.54,0
Copper layers (1*2*15*16): Top 0.035559375mm / dielectric 0.17018125mm / Route2 0.01778125mm / dielectric 47mil / Route15 0.01778125mm / dielectric 0.17018125mm / Bottom 0.035559375mm
Design rules "oshpark-4layer *": minimum track width 5mil, minimum drill 10mil, track to track 5mil, track to pad 5mil, pad to pad 5mil, via to via 5mil, smd to smd 5mil, copper to edge 15mil, drill to drill 6mil, minimum pad ring 4mil, minimum via ring 4mil, stop-mask expansion 2mil, vias tented up to drill 0.3mm, thermal gap 10mil
Holes 2.54 mm at 48.26,20.32 48.26,2.54
bRestrict: 3 lines

### Footprints (pad centres in the part's own frame; a part is rotated, then mirrored left to right if it is on the bottom)
C0805 = smd 1 x 1.5: 1 -1,0; 2 1,0
C0603 = smd 0.8 x 1: 1 -0.7,0; 2 0.7,0
CAPC1005X55N = smd 0.54 x 0.6: 1 -0.43,0; 2 0.43,0
SMA-MICRO = smd 1.5 x 1.05: 1 -0.625,0 | smd 0.85 x 0.95: 2 1.05,0
LED_EAST1005 = smd 0.5 x 0.5: A -0.525,0; C 0.525,0
R0402-M = smd 0.5 x 0.7: 1 -0.55,0; 2 0.55,0
CON-HEADER-1X12-MALE-PIN = drill 1.016 square: 1 0,0 | drill 1.016: 2 2.54,0; 3 5.08,0; 4 7.62,0; 5 10.16,0; 6 12.7,0; 7 15.24,0; 8 17.78,0; 9 20.32,0; 10 22.86,0; 11 25.4,0; 12 27.94,0
CON-HEADER-1X16-MALE-PIN = drill 1.016 square: 1 0,0 | drill 1.016: 2 2.54,0; 3 5.08,0; 4 7.62,0; 5 10.16,0; 6 12.7,0; 7 15.24,0; 8 17.78,0; 9 20.32,0; 10 22.86,0; 11 25.4,0; 12 27.94,0; 13 30.48,0; 14 33.02,0; 15 35.56,0; 16 38.1,0
TE_1909763-1 = smd 1 x 1.05: 1 0,-1.525 | smd 1.05 x 2.2: 2 -1.475,0; 3 1.475,0
MOLEX_104224-0820 = smd 1 x 2.3: G1 -5.1,1.5; G2 -5.1,8.7; G3 5.1,8.7; G4 5.1,1.5 | smd 1.1 x 1: R1 -1.82,12.625; R2 1.82,12.625 | smd 1 x 0.8: S1 4.9,4.35; S2 4.9,5.55; S3 -4.9,4.35; S4 4.9,6.75; S5 -4.9,5.55; S6 -4.9,6.75
JST_S2B-PH-SM4-TB(LF)(SN) = smd 1 x 3.5: 1 -1,0; 2 1,0 | smd 1.5 x 3.4: S1 -3.35,-5.75; S2 3.35,-5.75
JAE_DX07S016JA1R1500 = smd 0.52 x 1: 1 -3.1,1.1; 2 -2.35,1.1; 11 2.35,1.1; 12 3.1,1.1 | smd 0.27 x 1: 3 -1.75,1.1; 4 -1.25,1.1; 5 -0.75,1.1; 6 -0.25,1.1; 7 0.25,1.1; 8 0.75,1.1; 9 1.25,1.1; 10 1.75,1.1 | smd 1 x 2: S1 -1.4,-3.1; S2 1.4,-3.1 | drill 0.65 long: S3 -4.32,0.725; S4 4.32,0.725 | drill 0.65 pad 1.2 long: S5 -4.32,-3.1; S6 4.32,-3.1 | hole 0.6: 3,0 | hole 0.63: 3,0; -3,0
TC2030-MCP-NL = smd 0.787 x 0.787: 1 1.27,-0.635; 2 1.27,0.635; 3 2.54,-0.635; 4 2.54,0.635; 5 3.81,-0.635; 6 3.81,0.635 | hole 0.889: 0,0; 5.08,-1.016; 5.08,1.016
JUMPER-ROUND-NC = smd 0.2 x 0.2: P$1 -0.3,0; P$2 0.3,0
JUMPER-ROUND-N0 = smd 0.2 x 0.2: P$1 -0.3,0; P$2 0.3,0
IND-2P0X2P0X1P2 = smd 0.65 x 2: P$1 -0.675,0; P$2 0.675,0
IND0402_22N_TAI = smd 0.61 x 0.711: 1 -0.572,0; 2 0.572,0
DIO_RB558WMF-L = smd 0.254 x 0.483: 1 -0.5,-0.711; 2 0.5,-0.711; 3 0,0.711
SOT50P160X60-6N = smd 0.56 x 0.32: 1 -0.785,0.5; 2 -0.785,0; 3 -0.785,-0.5; 4 0.785,-0.5; 5 0.785,0; 6 0.785,0.5
SOT23 = smd 0.8 x 1.4: 1 -0.95,-1.1; 2 0.95,-1.1; 3 0,1.1
SW-EVP-AA402W = smd 1.15 x 1.05: 1 -1.675,0.725; 2 -1.675,-0.725; 3 1.675,0.725; 4 1.675,-0.725
TP-1P0 = smd 1 x 1: TP 0,0
NORDIC_NRF9160-SICA-R = smd 0.54 x 0.54: 1 -7.845,5.095; 21 -7.845,-5.095; 52 7.845,-5.095; 72 7.845,5.095 | smd 0.54 x 0.3: 2 -7.845,4.5; 3 -7.845,4; 4 -7.845,3.5; 5 -7.845,3; 6 -7.845,2.5; 7 -7.845,2; 8 -7.845,1.5; 9 -7.845,1; 10 -7.845,0.5; 11 -7.845,0; 12 -7.845,-0.5; 13 -7.845,-1; 14 -7.845,-1.5; 15 -7.845,-2; 16 -7.845,-2.5; 17 -7.845,-3; 18 -7.845,-3.5; 19 -7.845,-4; 20 -7.845,-4.5; 53 7.845,-4.5; 54 7.845,-4; 55 7.845,-3.5; 56 7.845,-3; 57 7.845,-2.5; 58 7.845,-2; 59 7.845,-1.5; 60 7.845,-1; 61 7.845,-0.5; 62 7.845,0; 63 7.845,0.5; 64 7.845,1; 65 7.845,1.5; 66 7.845,2; 67 7.845,2.5; 68 7.845,3; 69 7.845,3.5; 70 7.845,4; 71 7.845,4.5 | smd 0.3 x 0.54: 22 -7.25,-5.095; 23 -6.75,-5.095; 24 -6.25,-5.095; 25 -5.75,-5.095; 26 -5.25,-5.095; 27 -4.75,-5.095; 28 -4.25,-5.095; 29 -3.75,-5.095; 30 -3.25,-5.095; 31 -2.75,-5.095; 32 -2.25,-5.095; 33 -1.75,-5.095; 34 -1.25,-5.095; 35 -0.75,-5.095; 36 -0.25,-5.095; 37 0.25,-5.095; 38 0.75,-5.095; 39 1.25,-5.095; 40 1.75,-5.095; 41 2.25,-5.095; 42 2.75,-5.095; 43 3.25,-5.095; 44 3.75,-5.095; 45 4.25,-5.095; 46 4.75,-5.095; 47 5.25,-5.095; 48 5.75,-5.095; 49 6.25,-5.095; 50 6.75,-5.095; 51 7.25,-5.095; 73 7.25,5.095; 74 6.75,5.095; 75 6.25,5.095; 76 5.75,5.095; 77 5.25,5.095; 78 4.75,5.095; 79 4.25,5.095; 80 3.75,5.095; 81 3.25,5.095; 82 2.75,5.095; 83 2.25,5.095; 84 1.75,5.095; 85 1.25,5.095; 86 0.75,5.095; 87 0.25,5.095; 88 -0.25,5.095; 89 -0.75,5.095; 90 -1.25,5.095; 91 -1.75,5.095; 92 -2.25,5.095; 93 -2.75,5.095; 94 -3.25,5.095; 95 -3.75,5.095; 96 -4.25,5.095; 97 -4.75,5.095; 98 -5.25,5.095; 99 -5.75,5.095; 100 -6.25,5.095; 101 -6.75,5.095; 102 -7.25,5.095 | smd 0.8 x 0.8: 103_1 -6,3.2; 103_2 -4,3.2; 103_3 -2,3.2; 103_4 0,3.2; 103_5 2,3.2; 103_6 4,3.2; 103_7 6,3.2; 103_8 -6,1.6; 103_9 -4,1.6; 103_10 -2,1.6; 103_11 0,1.6; 103_12 2,1.6; 103_13 4,1.6; 103_14 6,1.6; 103_15 -6,0; 103_16 -4,0; 103_17 -2,0; 103_18 0,0; 103_19 2,0; 103_20 4,0; 103_21 6,0; 103_22 -6,-1.6; 103_23 -4,-1.6; 103_24 -2,-1.6; 103_25 0,-1.6; 103_26 2,-1.6; 103_27 4,-1.6; 103_28 6,-1.6; 103_29 -6,-3.2; 103_30 -4,-3.2; 103_31 -2,-3.2; 103_32 0,-3.2; 103_33 2,-3.2; 103_34 4,-3.2; 103_35 6,-3.2 | smd 0.3 x 0.3: 104 -5.75,-4.35; 105 -5.25,-4.35; 106 -4.75,-4.35; 107 -4.25,-4.35; 108 -1.75,-4.35; 109 -1.25,-4.35; 110 -0.75,-4.35; 111 -0.25,-4.35; 112 3.25,-4.35; 113 3.75,-4.35; 114 4.25,-4.35; 115 4.75,-4.35; 116 4.75,4.35; 117 4.25,4.35; 118 3.75,4.35; 119 3.25,4.35; 120 -0.25,4.35; 121 -0.75,4.35; 122 -1.25,4.35; 123 -1.75,4.35; 124 -4.25,4.35; 125 -4.75,4.35; 126 -5.25,4.35; 127 -5.75,4.35
SILABS_CP2102N-A02-GQFN20R = smd 0.3 x 0.3: 1 -1.25,1.25; 6 -1.25,-1.25; 11 1.25,-1.25; 16 1.25,1.25 | smd 0.9 x 0.3: 2 -1.55,0.75; 3 -1.55,0.25; 4 -1.55,-0.25; 5 -1.55,-0.75; 12 1.55,-0.75; 13 1.55,-0.25; 14 1.55,0.25; 15 1.55,0.75 | smd 0.3 x 0.9: 7 -0.75,-1.55; 8 -0.25,-1.55; 9 0.25,-1.55; 10 0.75,-1.55; 17 0.75,1.55; 18 0.25,1.55; 19 -0.25,1.55; 20 -0.75,1.55 | smd 1.8 x 1.8: 21 0,0
SON50P200X150X100-8N = smd 0.86 x 0.27: 1 -0.685,0.75; 2 -0.685,0.25; 3 -0.685,-0.25; 4 -0.685,-0.75; 5 0.685,-0.75; 6 0.685,-0.25; 7 0.685,0.25; 8 0.685,0.75
SON50P160X120X60-5N = smd 0.7 x 0.3: 1 -0.85,0.25; 2 -0.85,-0.25; 3 0.85,-0.25; 4 0.85,0.25 | smd 0.55 x 0.91: 5 0,0
WSON8_BQ2517_TEX-L = smd 0.606 x 0.28: 1 -0.951,0.75; 2 -0.951,0.25; 3 -0.951,-0.25; 4 -0.951,-0.75; 5 0.951,-0.75; 6 0.951,-0.25; 7 0.951,0.25; 8 0.951,0.75 | smd 0.991 x 1.702: 9 0,0
WIN_ZP-8-L = smd 0.86 x 0.403: 1 -2.818,1.905; 2 -2.818,0.635; 3 -2.818,-0.635; 4 -2.818,-1.905; 5 2.818,-1.905; 6 2.818,-0.635; 7 2.818,0.635; 8 2.818,1.905 | smd 3.454 x 4.343: 9 0,0
DFN10_2P7X2P7-L = smd 0.61 x 0.203: 1 -1.245,1; 2 -1.245,0.5; 3 -1.245,0; 4 -1.245,-0.5; 5 -1.245,-1; 6 1.245,-1; 7 1.245,-0.5; 8 1.245,0; 9 1.245,0.5; 10 1.245,1 | smd 1.245 x 2.159: 11 0,0
PQFN50P200X200100-12N = smd 0.575 x 0.268: 1 -0.875,0.75; 2 -0.875,0.25; 3 -0.875,-0.25; 4 -0.875,-0.75; 7 0.875,-0.75; 8 0.875,-0.25; 9 0.875,0.25; 10 0.875,0.75 | smd 0.268 x 0.575: 5 -0.25,-0.875; 6 0.25,-0.875; 11 0.25,0.875; 12 -0.25,0.875
FIDUCIAL-1MM = smd 1 x 1: 1 0,0
MOUNTING-HOLE-2.5MM-PLATED = drill 2.5 pad 3.2: P$1 0,0
XTAL320X150X90 = smd 0.85 x 1.6: 1 -1.275,0; 2 1.275,0

### Placement (x,y rotation side)
ASSEMBLY1  -173.5,-117.3 0 top  (outside the outline)
C3  27.15,3.8 270 top
C4  17.8,7.7 180 top
C5  15.15,7.7 0 top
C6  17.65,12.45 0 top
C8  25.9,9.7 180 top
C9  25.9,8.1 180 top
C10  19.7,12.1 90 top
C11  14.79,12.46 180 top
C12  46.45,14.1 0 top
C13  9.4,3.6 270 top
C14  9.35,5.65 180 top
C15  7.55,3.6 270 top
C16  7.5,5.65 180 top
C17  22.55,19.5 270 top
C18  36.05,14.45 270 bottom
C19  49.13,12.35 270 top
C20  28.75,4.8 270 top
C21  26.1,17.85 270 top
C22  28.2,18.95 0 top
D1  9.5,11.8 180 top
D3  2.54,17.3 180 top
D4  2.54,5.56 180 top
FB1  28.15,17.75 0 top
J2  16.51,21.59 0 top
J3  6.35,1.27 0 top
J4  47.55,6 180 top
J5  7.3,11.43 90 bottom
J6  11.23,15 180 top
J7  48.2,16.9 0 top
J8  5,11.43 270 top
J9  22.1,8.3 270 top
JMP1  35.8,16.1 0 bottom
JMP2  24.88,10.21 180 bottom
JMP3  34.15,16.05 90 bottom
JMP4  19.3,16.7 0 top
L2  19,5.8 90 top
L4  48.45,14.1 180 top
NTC1  22.68,10.4 0 bottom
PCB1  -172.43,-119.38 0 top  (outside the outline)
Q1  5.65,19.05 90 top
Q2  30.55,12.9 0 bottom
Q3  17.08,14.95 0 top
Q4  45,18.3 270 top
R1  33.95,19.15 180 top
R2  18.65,3.9 180 top
R3  31.05,11.2 180 bottom
R4  12.6,3.45 180 top
R5  32.65,10.05 0 bottom
R6  8.8,18.15 180 bottom
R7  22.68,11.53 0 bottom
R8  28.95,11.2 180 bottom
R9  29.7,18.2 90 top
R10  28.55,12.95 270 bottom
R11  4.85,17.3 0 top
R12  22.68,12.66 0 bottom
R13  44.95,19.95 180 top
R14  4.85,5.56 0 top
R15  10.85,5.15 270 top
R16  12.05,5.15 90 top
R17  38.35,19.25 90 top
R18  37.15,19.25 90 top
R19  14.4,4.65 270 top
R20  32.75,18.7 0 bottom
R21  8.8,19.35 180 bottom
R24  14.8,20.75 270 bottom
SOLDER1  -173.7,-118.9 0 top  (outside the outline)
SW1  41.4,3.8 180 top
SW2  41.4,19.06 180 top
TP1  23.9,4.9 0 bottom
TP2  25.3,7 0 bottom
TP3  23.97,9.06 0 bottom
TP4  39.69,6.49 0 bottom
TP5  41.35,8.72 0 bottom
TP6  22.27,6.97 0 bottom
TP7  3.87,12.13 0 bottom
TP8  5.6,10.73 0 bottom
U1  36,11.43 0 top
U2  10.7,8.55 0 top
U3  16.25,5.5 0 top
U4  47.14,12.57 0 top
U5  16.35,10.75 0 top
U6  23.8,13.35 180 top
U8  20.25,19.1 0 top
U10  38.1,15.8 270 bottom
U$1  [13#A00]  16.5,1.55 90 bottom
U$2  [LOGO-CIRCUITDOJO]  48.56,11.72 0 bottom
U$3  49.4,12.3 0 bottom
U$4  1.75,11.4 0 bottom
U$5  [A3L-LOC]  -165.15,-120.15 0 top  (outside the outline)
U$6  [LOGO-OSHWA]  31.31,13.67 0 bottom
U$7  [LOGO-CE]  35.55,5.55 0 bottom
U$8  [290]  39.39,17.78 90 bottom
U$9  [BAT0]  16.5,16.7 90 bottom
U$10  [20]  29.23,18.66 90 bottom
U$11  [30]  26.69,18.66 90 bottom
U$12  [310]  44.45,1.5 90 bottom
U$13  [00]  34.31,18.63 90 bottom
U$14  [MD0]  11.45,1.55 90 bottom
U$15  [#RST0]  6.37,1.41 90 bottom
U$16  [24#TX0]  41.9,1.5 90 bottom
U$17  [23#RX0]  39.35,1.55 90 bottom
U$18  [220]  36.8,1.5 90 bottom
U$19  [210]  34.25,1.55 90 bottom
U$20  [190]  31.75,1.55 90 bottom
U$21  [GPS0]  50.15,16.85 0 bottom
U$22  [LTE0]  50.25,6.35 0 bottom
U$23  [RST0]  34.15,3.7 0 top
U$24  [10]  31.72,18.93 90 bottom
U$25  [#EN0]  19,17.75 90 bottom
U$26  [SCL#270]  41.93,14.39 90 bottom
U$27  [SDA#260]  44.47,14.14 90 bottom
U$28  [300]  36.85,17.73 90 bottom
U$31  2.54,20.32 270 top
U$32  2.54,2.54 270 top
U$34  5.6,21.35 270 top
U$35  45.3,3.25 270 top
U$39  [14#A10]  19.05,1.55 90 bottom
U$40  [15#A20]  21.6,1.55 90 bottom
U$41  [16#A30]  24.15,1.55 90 bottom
U$42  [17#A40]  26.7,1.55 90 bottom
U$43  [18#A50]  29.25,1.55 90 bottom
U$69  [GND12]  13.99,1.55 90 bottom
U$71  [3V314]  8.91,1.55 90 bottom
U$73  [VUSB25]  21.61,15.63 90 bottom
U$89  [412]  24.15,18.66 90 bottom
Y1  17.45,18.8 90 top

### Tracks (layer width: path | path; a pad name or v marks a point on that pad's centre or on a via)
!RESET  (via drill 0.25)
  Top 0.152: SW1.3 v41.35,3.08 SW1.1 | U1.32 33.7,6.38 33.7,3.9 v33.67,3.88 | U2.2 8.95,9.3 8.93,9.32 v8.93,10.05
  Route15 0.152: v8.93,10.05 8.93,7.28 6.35,4.7 J3.1
  Bottom 0.152: v41.35,3.08 34.48,3.08 v33.67,3.88 32.85,3.05 31.4,3.05 31.38,3.07 31.34,3.03 30.07,3.03 30.04,3 24.71,3 23.59,4.12 19.88,4.12 19.02,3.27 14.83,3.27 14.82,3.28 12.68,3.28 11.71,2.3 7.38,2.3 J3.1
+3V3  (via drill 0.25)
  Top 0.152: R17.2 R18.2 36.65,19.8 36.45,20 v36.42,19.98 | R11.2 5.94,17.3 v6.09,17.45 | 26.57,9.93 26.6,9.9 C8.1 | U8.10 22.5,20.1 22.55,20.05 C17.1 22.55,20.38 v22.8,20.63
  Top 0.254: C8.1 26.6,9.95 27.58,10.93 U1.12
  Top 0.305: v45.45,13.15 45.78,12.82 U4.1 | U1.22 C20.1 | v26,10.5 26.57,9.93
  Bottom 0.152: v35.24,14.54 35.67,14.54 C18.1 36.09,14.93 U10.10 37.35,14.45 37.5,14.3 37.7,14.3 37.85,14.45 U10.9 | R20.2 31.76,18.7 31.63,18.57 31.27,18.57 31.26,18.58 v30.43,18.58
  other vias: 20.1,10.55 20.6,10.75 21.1,10.75 21,10.25 20.1,7.15 25.55,19.78 26.15,19.78 26.8,19.78 27.5,19.78 19.85,7.6 19.5,7.2 20.15,8.05 19.6,8.05 25.75,5.23 25.75,4.68 25.75,4.13 25.25,4.98 25.25,4.38 19.9,8.5 19.35,8.5 19.3,7.65 20.4,7.6 20.4,8.5
  pour Route15 (isolate 0.152, rank 2): 50.8,0 0,0 0,22.86 50.8,22.86
  pour Top (no thermals): 19.2,11.9 19.2,10.9 20.05,10.05 20.9,10.05 21.4,10.55 21.4,11.6 20.5,11.6 20.2,11.9
  pour Top (no thermals): 16.45,6.4 16.45,6.2 20.85,6.2 21.4,6.75 21.4,7.85 20.55,8.7 18.4,8.7 17.95,8.25 17.95,6.9 17.9,6.85 17.35,6.4
  pour Top (no thermals): 25.3,18.05 25.2,18.15 25.2,20.05 27.9,20.05 27.95,20 27.95,17.4 27.2,17.4 27.2,17.75 26.9,18.05
  pour Top (no thermals): 24.95,5.05 24.95,4.2 25.35,3.8 27.4,3.8 28.4,4.8 29.15,4.8 29.25,4.9 29.25,5.6 25.5,5.6
ANT
  Top 0.3: J4.1 47.55,8.39 arc90 45.01,10.93 U1.61
CHG_ISET  (via drill 0.25)
  Top 0.152: U5.2 14.95,11 v14.7,11.25
  Bottom 0.152: v14.7,11.25 14.89,11.44 14.89,12.45 15.62,13.18 16.53,13.18 17.26,12.45 20.6,12.45 20.81,12.66 R12.2
CHG_STAT  (via drill 0.25)
  Top 0.152: D4.C 1.96,5.5 v1.3,5.5 | U5.5 | U5.5 17.9,10 v18,10.1
  Bottom 0.152: v18,10.1 17.9,10.2 13.4,10.2 10.2,7 10.2,5.7 9.8,5.3 1.5,5.3 v1.3,5.5
CHG_TS  (via drill 0.25)
  Top 0.152: v14.67,10.65 14.82,10.5 U5.3
  Bottom 0.152: v14.67,10.65 14.76,10.55 18.3,10.55 19,11.25 21.28,11.25 NTC1.2 22.73,9.8 24.17,9.8 JMP2.P$1
CHG_VSET  (via drill 0.25)
  Top 0.152: v17.96,11.03 17.93,11 U5.7
  Bottom 0.152: v17.96,11.03 18.46,11.53 R7.2
COEX0/GPS_EN  (via drill 0.25)
  Top 0.152: v33.4,15.45 33.25,15.45 U1.93 33.25,17.09 33.38,17.22 33.38,19.19 R1.2 | v48.01,11.62 47.99,11.64 U4.3
  Route2 0.152: v33.4,15.45 33.88,14.97 42.28,14.97 45.08,12.17 47.46,12.17 v48.01,11.62
CP2102N-!RST
  Top 0.152: U2.9 10.95,6.55 11.18,6.33 12.38,6.33 13.15,5.55 R4.1
CP2102N-VDD
  Top 0.305: C15.1 7.93,5.16 C16.1 8.68,6.4 9.1,6.4 9.45,6.75 U2.6
DIFF_N  (via drill 0.25)
  Top 0.152: J8.5 5.08,12.18 v4.95,12.05 4.8,11.9 4.8,11.1 5.22,10.68 J8.8 6.82,10.68 7.1,10.4 7.1,9.3 8.6,7.8 U2.5
  Bottom 0.152: v4.95,12.05 3.96,12.05 TP7.TP
DIFF_P  (via drill 0.25)
  Top 0.152: U2.4 8.6,8.3 7.5,9.4 7.5,10.7 v7.02,11.18 J8.7 5.42,11.18 5.25,11.35 5.25,11.5 5.43,11.68 J8.6
  Bottom 0.152: v7.02,11.18 6.57,10.73 TP8.TP
EN  (via drill 0.25)
  Top 0.152: U3.4 15.56,4.21 v15.35,4 15.3,3.95 14.55,3.95 R19.2
  Route15 0.152: J2.2 19.05,16.45 19.25,16.25 19.25,15.25 16.78,12.78 16.78,12.07 15.35,10.64 v15.35,4
FLASH_CS  (via drill 0.25)
  Top 0.152: U1.4 28.98,14.93 v29.05,14.85 | v27.4,12 27.4,11.8 27.05,11.45 U6.1
  Route2 0.152: v27.4,12 27.2,12 26.17,13.03 26.17,13.58 26.42,13.83 28.03,13.83 v29.05,14.85
FLASH_HOLD  (via drill 0.25)
  Top 0.152: U6.7 21.23,12.71 21.53,12.42 v21.53,12.13 | v27.45,7.85 28.07,7.85 U1.18
  Route2 0.152: v21.53,12.13 23.17,12.13 v27.45,7.85
FLASH_SCK  (via drill 0.25)
  Top 0.152: v29.23,7.82 28.88,7.82 28.49,7.43 U1.19 | U6.6 21.28,13.98 v21.72,13.55
  Route2 0.152: v21.72,13.55 21.85,13.42 24.02,13.42 29.23,8.21 v29.23,7.82
FLASH_SI  (via drill 0.25)
  Top 0.152: U6.5 21.51,14.73 v21.51,14.6 | v29.55,9.07 29.41,8.93 U1.16
  Route2 0.152: v21.51,14.6 23.25,14.6 28.84,9.02 29.5,9.02 v29.55,9.07
FLASH_SO  (via drill 0.25)
  Top 0.152: U1.86 36.75,15.43 36.95,15.22 v36.95,13.15 | U6.2 26.62,13.38 v26.6,13.4
  Route2 0.152: v26.6,13.4 26.62,13.43 27.09,12.96 36.76,12.96 v36.95,13.15
FLASH_WP  (via drill 0.25)
  Top 0.152: U6.3 26.5,14.1 v26.5,14.55 | U1.15 28.17,9.45 v29.05,9.45
  Route2 0.152: v26.5,14.55 26.5,14.31 25.89,13.7 25.89,12.41 28.85,9.45 v29.05,9.45
GND  (via drill 0.25)
  Top 0.152: U1.90 34.7,16.57 34.7,17 34.48,17.22 33.92,17.22 v33.85,17.29 v33.85,17.3 | 10.55,8.75 10.55,8.7 U2.21 | U3.3 15.58,5.24 15.91,5.24 16.2,4.95 16.2,4.2 v16.05,4.2 | 8.35,9.07 8.35,9.4 v8.15,9.6 | C22.2 28.25,18.57 28.25,17.15 | C14.2 8.92,5.57
  Top 0.2: 8.92,5.57 8.35,5
  Top 0.254: 39.75,16.38 39.75,17 | 40.25,16.38 40.25,17 | 40.75,16.38 40.75,17 | 30.89,16.99 31.45,17.55 v31.45,17.95 | 11.55,7.8 U2.12 v13.2,7.8 | U2.3 8.61,8.8 8.35,9.07
  Top 0.305: U1.98 30.75,16.85 30.89,16.99 | U1.94 32.75,17.06 32.86,17.17 32.86,17.31 v32.95,17.4 | U2.3 10.5,8.8 10.55,8.75
  Top 0.508: J8.12 7.08,8.33 v7.15,8.4 | J8.1 7.38,14.53
  Route2 0.65: 5.22,15.75 6.23,15.75 | 2.55,15.75 1.24,15.75 | 2.55,7.11 1.24,7.11 | 5.22,7.11 6.23,7.11
  Route15 0.152: J8.S5 2.55,15.75 | J8.S3 5.22,15.75 | J8.S4 6.23,7.11 | J8.S6 2.55,7.11
  Route15 0.65: 5.22,15.75 6.23,15.75 | 2.55,15.75 1.24,15.75 | 2.55,7.11 1.24,7.11 | 5.22,7.11 6.23,7.11
  Bottom 0.152: U10.5 39.65,16.05 39.7,16 | U10.6 39.85,15.55 39.9,15.5 | U10.8 38.35,14.15 38.3,14.1 | U10.7 38.85,14.2 38.9,14.15
  Bottom 0.3: 13.9,5.3 13.9,5.75
  other vias: 31.45,19 28.05,20.6 27.25,16.35 27.5,16.8 9.15,15.05 11.15,15.2 11.15,14.65 31.25,5.3 31.25,4.6 31.2,4 33,9.15 32.95,12.15 32.95,11 15.35,1.3 15.35,0.7 45.9,10.2 45.3,10.35 46.45,9.75 48.55,7.6 45.3,17.55 43.55,17.35 46.45,7.6 46.8,9.2 22.9,21.85 22.9,21.25 32.95,17.95 34,18.2 44.8,13.15 44.7,10.35 48.05,8.75 48.4,8.25 47.95,9.35 47.65,10 47.25,10.5 46.75,10.9 46.15,11.25 45.4,11.45 44.7,11.5 46.95,8.6 49.75,15.15 47.15,15.05 27.4,13.4 39,9.95 39,12.4 39,11.25 41,9.95 41,12.4 41,11.25 12.75,1.85 12.75,1.25 12.75,0.65 9.15,14.5 9.15,15.6 16.55,8.8 17.15,8.8 17.8,8.8 13.1,8.35 8.35,10.1 7.05,7.85 7.55,8.05 7.45,7.55 7.95,7.7 7.15,7.1 7.15,14.5 7.1,15.05 7.6,14.85 7.5,15.35 8,15.2 7.95,14.45 13.65,5.45 13.65,4.95 13.65,4.4 24.2,7.55 18.95,13.95 18.9,12 24.4,7.05 49.2,10.9 46.55,8.2 44.75,14.6 45.3,14.8 45.9,15 46.5,15.05 46.15,13.4 48.4,13.4 47.15,11.55
  pour Top (isolate 0.152, rank 3): 0,22.86 0,0 50.8,0 50.8,22.86
  pour Bottom (isolate 0.152, rank 2): 50.8,0 0,0 0,22.86 50.8,22.86
  pour Route2 (isolate 0.152, rank 2): 0,22.86 0,0 50.8,0 50.8,22.86
  pour Top (rank 2, no thermals): 15.95,6.2 15.2,6.2 15.2,8.5 15.25,8.55 17.55,8.55 17.55,6.8 17.45,6.7 16.45,6.7
GPS
  Top 0.3: C12.1 45.75,14.1 arc39 45.55,14.03 arc-49 45.15,13.93 U1.67
GPS_ANT
  Top 0.3: J7.1 47.88,15.05 L4.2 C12.2
LIS2DH_INT1
  Bottom 0.152: JMP1.P$1 36.15,16.05 U10.12
LIS2DH_INT2
  Bottom 0.152: U10.11 36.55,15.55 36.4,15.4 34.5,15.4 JMP3.P$1
LNA_SW_OUT
  Top 0.3: L4.1 49.11,14.01 49.11,12.8 C19.1 49.11,12.8
  Top 0.305: U4.4 49.09,12.82 49.11,12.8
MODE/WAKE  (via drill 0.25)
  Top 0.152: Q4.1 44.29,19.84 R13.2 44.23,19.79 SW2.2 43.02,19.73 v41.2,19.73 39.77,19.73 SW2.4
  Route15 0.152: v42.66,7.59 39.34,7.59 39.15,7.39 30.54,7.39 26.47,3.32 24.29,3.32 23.49,4.12 20.56,4.12 19.43,2.99 v19.39,2.99
  Bottom 0.152: v41.2,19.73 41.4,19.73 42.4,18.73 42.4,7.8 42.61,7.59 v42.66,7.59 | J3.3 11.43,1.58 12.85,3 14.71,3 14.72,2.99 v19.39,2.99
N$1
  Top 0.152: R2.2 18.09,3.92 18,3.92 18,4.1 17.35,4.75 U3.5
N$2
  pour Top (no thermals): 16.45,5.8 16.45,5.6 17.35,5.6 18.1,4.85 20.05,4.85 20.05,5.8
N$3
  Bottom 0.152: U10.2 37.85,17.35 38,17.5 38,17.88 37.75,18.13 35.42,18.13 34.85,18.7 R20.1
N$4
  Top 0.152: R9.1 29.7,17.4 29.25,16.95 U1.101
N$5
  Top 0.152: C9.1 27.25,8.75 27.25,10.1 27.58,10.43 U1.13
N$6
  Bottom 0.152: R3.2 31.45,11.35 31.45,12.4 Q2.3
N$7
  Bottom 0.152: Q2.5 Q2.6 28.65,13.4 R10.1
N$8
  Top 0.152: R11.1 4.42,17.24 4.36,17.3 D3.A
N$10
  Top 0.152: U8.1 17.48,20.1 Y1.2
N$11
  Top 0.15: R15.1 R16.2
  Top 0.152: U2.8 10.45,6.1 R15.1
N$12
  Top 0.152: D3.C 2.71,18 4.45,18 4.94,18.49 Q1.3
N$13
  Top 0.152: D4.A R14.1
N$16
  Top 0.152: FB1.2 29.1,18.15 29.55,18.15 29.7,18.3 R9.2
  Top 0.305: FB1.2 28.75,17.7 U1.102
N$18
  Top 0.152: Y1.1 17.45,18.7 17.95,19.2 18.3,19.2 18.7,19.6 U8.2
P0.00/D4
  Top 0.152: J2.8 34.19,21.59 32.46,19.86 32.46,17.27 32.25,17.06 U1.95
P0.01/D5
  Top 0.152: U1.96 31.75,16.95 32.18,17.38 32.18,21.16 J2.7
P0.02/D6
  Top 0.152: U1.97 31.25,16.85 31.9,17.5 31.9,19.95 30.26,21.59 J2.6
P0.03/D7  (via drill 0.25)
  Top 0.152: U1.99 30.25,16.85 31,17.6 31,19.1 29.6,20.5 28.8,20.5 27.71,21.59 J2.5 | Q1.1 6.8,18.99 6.8,19.33 6.81,19.34 6.81,20.04 v6.6,20.25
  Bottom 0.152: v6.6,20.25 7.3,20.95 12.75,20.95 13.53,20.17 14.77,20.17 | J2.5 25.25,20.17 14.77,20.17 | R24.2 14.77,20.17
P0.04/D8  (via drill 0.25)
  Top 0.152: U1.100 29.75,16.85 30.1,17.2 30.13,17.2 30.5,17.56 v30.5,17.9 | v20.2,16.35 JMP4.P$2
  Route2 0.152: v30.5,17.9 30.1,17.9 27.7,20.3 25.42,20.3 J2.4 23.53,20.99 23.53,20.04 20.2,16.7 v20.2,16.35
P0.05/USB_UART_RX  (via drill 0.25)
  Top 0.152: U1.2 27.55,15.93 v27.37,15.75 | v11.13,10.96 10.95,10.78 U2.18
  Route2 0.152: v27.37,15.75 26.98,15.37 21.26,15.37 16.1,10.21 13.24,10.21 12.49,10.96 v11.13,10.96
P0.06/USB_UART_TX  (via drill 0.25)
  Top 0.152: U1.3 28.14,15.45 27.74,15.45 27.44,15.15 v27.44,14.85 | U2.17 11.45,10.35 11.75,10.65 11.94,10.65 v12.11,10.48
  Route2 0.152: v27.44,14.85 27.04,14.85 26.82,15.06 21.35,15.06 16.22,9.93 13.12,9.93 12.57,10.48 v12.11,10.48
P0.12/MD  (via drill 0.25)
  Top 0.152: v46.25,18.93 46.25,18.84 Q4.3 | v9.44,10.5 v9.45,10.49 U2.1 | v29,7.28 28.65,6.93 U1.20
  Route2 0.152: v9.44,10.5 11.38,10.5 12.22,9.65 16.34,9.65 17.29,10.6 18.19,10.6 20.2,12.61 23.08,12.61 27.41,8.28 27.63,8.28 28.63,7.28 v29,7.28
  Bottom 0.152: v29,7.28 29,7.18 29.85,6.33 31.62,6.33 32,5.95 37.42,5.95 38.74,4.63 41.38,4.63 44.1,7.36 44.1,17.04 46,18.93 v46.25,18.93
P0.13/A0  (via drill 0.25)
  Top 0.152: U1.23 29.25,6.75 v29.7,7.2
  Route15 0.152: v29.7,7.2 29.7,6.95 26.35,3.6 24.41,3.6 23.61,4.4 20.45,4.4 19.64,3.6 18.84,3.6 J3.5
P0.14/A1  (via drill 0.25)
  Top 0.152: U1.24 29.75,4.65 v29.55,4.45
  Route2 0.152: v29.55,4.45 29.37,4.27 27.35,4.27 25.6,2.52 24.64,2.52 24.02,3.14 24.02,3.59 23.49,4.12 20.71,4.12 20.18,3.59 20.18,2.4 J3.6
P0.15/A2  (via drill 0.25)
  Top 0.152: U1.25 30.25,4.43 v30.22,4.43
  Route2 0.152: v30.22,4.43 v30.22,4.42 30.18,4.42 29.75,3.99 27.47,3.99 25.71,2.23 23.73,2.23 22.76,1.27 J3.7
P0.16/A3  (via drill 0.25)
  Top 0.152: v30.25,3.8 30.75,4.3 U1.26
  Route2 0.152: v30.25,3.8 30.15,3.7 27.61,3.7 25.18,1.27 J3.8
P0.17/A4  (via drill 0.25)
  Top 0.152: U1.28 31.75,3.9 30.45,2.6 v30.25,2.6
  Route2 0.152: J3.9 27.9,2.5 30.15,2.5 v30.25,2.6
P0.18/A5
  Top 0.152: U1.29 32.25,3.95 29.57,1.27 J3.10
P0.19/SCK
  Top 0.152: U1.30 32.75,4.05 31.75,3.05 J3.11
P0.20/VBAT_MEAS  (via drill 0.25)
  Top 0.152: U1.35 35.25,5.3 v35.21,5.26
  Route2 0.152: v32.76,8.02 35.21,5.56 v35.21,5.26
  Bottom 0.152: R8.2 R3.1 30.5,10.28 v32.76,8.02
P0.21/COPI
  Top 0.152: U1.37 36.3,6.38 36.3,3.28 J3.12
P0.22/CIPO
  Top 0.152: U1.38 36.75,1.35 J3.13
P0.23/RX
  Top 0.152: U1.39 37.25,3.39 J3.14
P0.24/TX  (via drill 0.25)
  Top 0.152: v37.9,4.15 37.75,4.3 U1.40
  Route2 0.152: v37.9,4.15 39.03,4.15 J3.15
P0.25/VBAT_MEAS_EN  (via drill 0.25)
  Top 0.152: U1.42 38.75,7.61 v38.97,7.83
  Bottom 0.152: v38.97,7.83 38.71,7.56 33.83,7.56 32.05,9.33 32.05,10.1 | Q2.2 31.7,12.9 32.05,12.55 32.05,10.1 | R5.2 32.05,10.1
P0.26/SDA  (via drill 0.25)
  Top 0.152: v22.2,17.97 22.06,18.1 U8.6 | v38.95,17.5 38.4,17.5 | U1.83 38.25,17.35 38.4,17.5 | 38.4,17.5 38.35,17.55 R17.1
  Route2 0.152: J2.12 44.35,21.59 40.26,17.5 v38.95,17.5 38.25,17.5 36.97,16.22 29.93,16.22 28.59,17.56 22.6,17.56 v22.2,17.97
  Bottom 0.152: v38.95,17.5 38.85,17.4 U10.4
P0.27/SCL  (via drill 0.25)
  Top 0.152: U1.84 37.75,17.52 v37.57,17.7 37.15,18.12 R18.1 | U8.7 22.1,18.6 22.3,18.4 v22.6,18.4
  Route2 0.152: J2.11 41.91,19.56 40.28,17.93 37.8,17.93 v37.57,17.7 37.57,17.21 36.85,16.5 30.05,16.5 28.7,17.85 23.1,17.85 22.6,18.35 v22.6,18.4
  Bottom 0.152: U10.1 37.35,17.38 37.57,17.6 v37.57,17.7
P0.29/D2  (via drill 0.25)
  Top 0.152: v36.43,17.53 36.25,17.35 U1.87
  Route2 0.152: J2.10 39.37,20.47 v36.43,17.53
  Bottom 0.152: v36.43,17.53 36.43,17.57 36.2,17.8 35.5,17.8 34.15,16.45 JMP3.P$2
P0.30/D3  (via drill 0.25)
  Top 0.152: v35.73,17.26 35.73,16.54 U1.88
  Route2 0.152: v35.73,17.26 35.73,17.53 37.38,19.18 37.38,21.04 J2.9
  Bottom 0.152: JMP1.P$2 35.5,17.03 v35.73,17.26
P0.31  (via drill 0.25)
  Top 0.152: v34.35,17.65 34.85,17.65 35.25,17.25 U1.89
  Route2 0.152: J3.16 39.13,6.59 38.54,6.59 37.1,8.03 v37.1,10.55
  Bottom 0.152: v37.1,10.55 37.1,11.14 32.97,15.27 32.97,16.17 33.67,16.87 34.03,16.87 34.35,17.19 v34.35,17.65
RTC_INT
  Top 0.152: U8.4 18.65,18.6 18.46,18.41 18.46,17.24 JMP4.P$1
SIM_CLK  (via drill 0.25)
  Top 0.152: U1.46 40.75,5.7 v40.7,5.7
  Bottom 0.152: v40.7,5.7 v40.7,5.69 40.23,5.22 39.03,5.22 37.73,6.52 32.33,6.52 30.25,8.6 24.43,8.6 TP3.TP 23.77,9.25 21.48,9.25 20.85,8.62 20.85,6.97 20.5,6.62 18.65,6.62 17.94,7.33 12.45,7.33 J5.S3 11.66,6.53
SIM_IO  (via drill 0.25)
  Top 0.152: U1.48 41.75,5.75 v41.8,5.7
  Bottom 0.152: v41.8,5.7 41.35,5.7 40.59,4.94 38.92,4.94 37.62,6.24 32.2,6.24 30.12,8.32 23.62,8.32 TP6.TP 21.64,6.34 18.53,6.34 17.82,7.05 14.55,7.05 14.05,6.55 J5.S6
SIM_RST  (via drill 0.25)
  Top 0.152: v39.2,5.7 39.25,5.75 U1.43
  Bottom 0.152: J5.S2 12.85,17.35 13.22,17.72 19.47,17.72 27.28,9.92 29.38,9.92 32.47,6.83 38.08,6.83 v39.2,5.71 v39.2,5.7 39.2,5.75 39.69,6.24 TP4.TP
SIM_VCC  (via drill 0.25)
  Top 0.152: v42.1,7.13 42.1,7.08
  Top 0.305: U1.49 42.25,6.93 42.1,7.08
  Bottom 0.305: J5.S1 11.65,17.05 12.68,18.08 19.62,18.08 27.42,10.28 29.53,10.28 32.6,7.21 39.21,7.21 39.66,7.66 41.35,7.66 | v42.1,7.13 41.58,7.66 41.35,7.66 | TP5.TP 41.35,7.66
SWCLK  (via drill 0.25)
  Top 0.152: U1.33 34.25,5.53 34.17,5.45 v34.15,5.45 | J9.4 23.38,6.4 v23.55,6.4
  Bottom 0.15: 25.3,6.9 TP2.TP
  Bottom 0.152: v23.55,6.4 23.77,6.62 24.58,6.62 24.86,6.9 25.3,6.9 26.15,6.05 31.51,6.05 32.11,5.45 v34.15,5.45
SWDIO  (via drill 0.25)
  Top 0.152: U1.34 34.75,4.6 v34.9,4.45 | J9.2 22.8,7.1 v23.5,7.1
  Bottom 0.152: v23.5,7.1 23,6.6 23,5.82 23.9,4.92 | 23.9,4.92 24.75,5.77 31.39,5.77 32.71,4.45 v34.9,4.45 | 23.9,4.92 TP1.TP
USB_CC1  (via drill 0.25)
  Top 0.152: J8.3 5.24,13.18 v5.2,13.22
  Bottom 0.152: v5.2,13.22 4.83,13.22 4.23,13.82 4.23,16.28 6.09,18.15 R6.1
USB_CC2  (via drill 0.25)
  Top 0.152: J8.9 5.12,10.18 4.4,10.9 4.4,12.2 v4.85,12.65
  Bottom 0.152: R21.1 7.45,18.55 6.1,18.55 3.95,16.4 3.95,13.6 4.85,12.7 v4.85,12.65
VBAT  (via drill 0.25)
  Bottom 0.152: Q2.4 R10.2 27.85,13.1 27.85,13.61 27.31,14.15 26.71,14.15 26.68,14.12 24.09,14.12 19.76,18.44 16,18.44 v15.85,18.59
  pour Top (rank 2, no thermals): 15.37,16.7 15.37,13.3 11.75,13.3 11.75,16.7 14.45,16.7 15.35,17.6 15.35,16.72
  pour Top (no thermals): 15.55,15.6 15.1,16.05 15.1,22.55 17.25,22.55 17.25,20.9 16.45,20.9 16.45,16.9 17,16.9 17,15.6
  pour Top (rank 2, no thermals): 15.3,15.8 17.6,15.8 17.6,11.4 16.55,11.4 16.55,12.25 15.3,13.5
VBUS  (via drill 0.25)
  Top 0.15: C14.1 9.78,5.78
  Top 0.152: R14.2 5.4,4.83 v5.37,4.81 | R4.2 11.09,3.45 v10.97,3.34
  Top 0.305: 9.78,5.78 9.95,5.95 U2.7
  Route2 0.152: v5.37,4.81 5.37,4.88 3.68,6.57 3.65,6.6
  Route2 0.254: v7.75,13 v8.3,13 8.5,13.2 8.8,13.2 | v4.2,9.05 3.65,8.5
  Route2 0.305: v10.72,3.79 10.95,3.56 10.95,3.5 | v5.37,4.81 5.44,4.81 5.9,4.35
  Route2 1.27: 3.65,6.6 3.65,8.5 3.65,9.3 5.93,11.58 5.93,11.59 7.54,13.2 8.8,13.2 15.6,13.2 15.95,12.85 15.95,15.45 21.59,21.09 J2.3 | 3.68,6.57 5.9,4.35 6.75,3.5 10.95,3.5
  other vias: 8.5,13.45 8,13.45 7.5,13.45 7.2,13 11.22,3.79 10.42,3.34 16.35,12.25 15.85,12.75 16.35,12.75 3.8,9.45 4.35,9.6 3.95,9.95 4.5,10.15 4.9,9.75 15.85,12.25
  pour Top (no thermals): 10.1,5.9 9.7,5.9 9.7,5.3 9.6,5.3 9.1,4.8 9.1,3.2 11.3,3.2 11.3,4.8 10.9,4.8 10.4,5.3 10.4,5.6
  pour Top (no thermals): 5.65,14 5.65,13.55 6.7,13.55 6.85,13.4 6.85,11.75 7.4,11.2 8.85,11.2 8.85,13.45 8.3,14
  pour Top (no thermals): 14.85,11.35 14.85,14.05 15.5,14.7 16.55,14.7 16.55,11.35
  pour Top (no thermals): 4.55,10.35 3.9,10.35 3.55,10 3.55,9.4 4.05,8.9 6.55,8.9 6.55,9.3 5.6,9.3
  pour Route2: 15.05,13.05 15.05,12.75 15.8,12 16.51,12 16.51,13.05
VSYS  (via drill 0.25)
  Top 0.152: SW2.1 v41.95,18.34 SW2.3 | 14.35,5.65 14.7,6
  Route2 0.152: v41.95,18.34 41.5,18.34 40.24,17.07 38.31,17.07 37.19,15.94 29.81,15.94 28.48,17.28 23.75,17.28 23.14,16.67 21.14,16.67 20.22,15.75 18.75,15.75 v18.65,15.85
  Route15 0.508: v18,15.05 18.35,15.4 v18.35,15.45 17.44,14.54 17.36,14.54
  Route15 1.27: 18.31,15.49 17.36,14.54 16.55,13.74 14.39,13.74 v12.45,11.8 v11.9,11.8
  other vias: 17.85,15.55 11.65,12.2 12.2,12.2 12.75,12.2 11.6,11.4 12.15,11.4 12.75,11.4 18.15,15.95
  pour Top (no thermals): 18.85,16.15 17.7,16.15 17.7,13.15 18.45,13.15 18.45,14.45 19.1,15.1 19.1,15.9
  pour Top (no thermals): 11,11.1 9.25,11.1 9.25,12.5 12.9,12.5 13.5,11.9 13.5,10.45 15.03,8.92 15.03,5.95 15.95,5.95 15.95,5.25 14.1,5.25 14.1,8

### Text on the board
bPlace: -X | Y | BRD-0015-08 | nRF9160 Feather
Document: nRF9160 Featherwing | Notes: / / * T4 solder paste / * Lead Free assembly / * Measures in mm | Confidential - Property of Circuit Dojo LLC
tDocu: TOP
bDocu: BOT | (Top down)